# EAGLE design LinSen_beta (EAGLE 9.2.0)

## Sheet 1 of 5
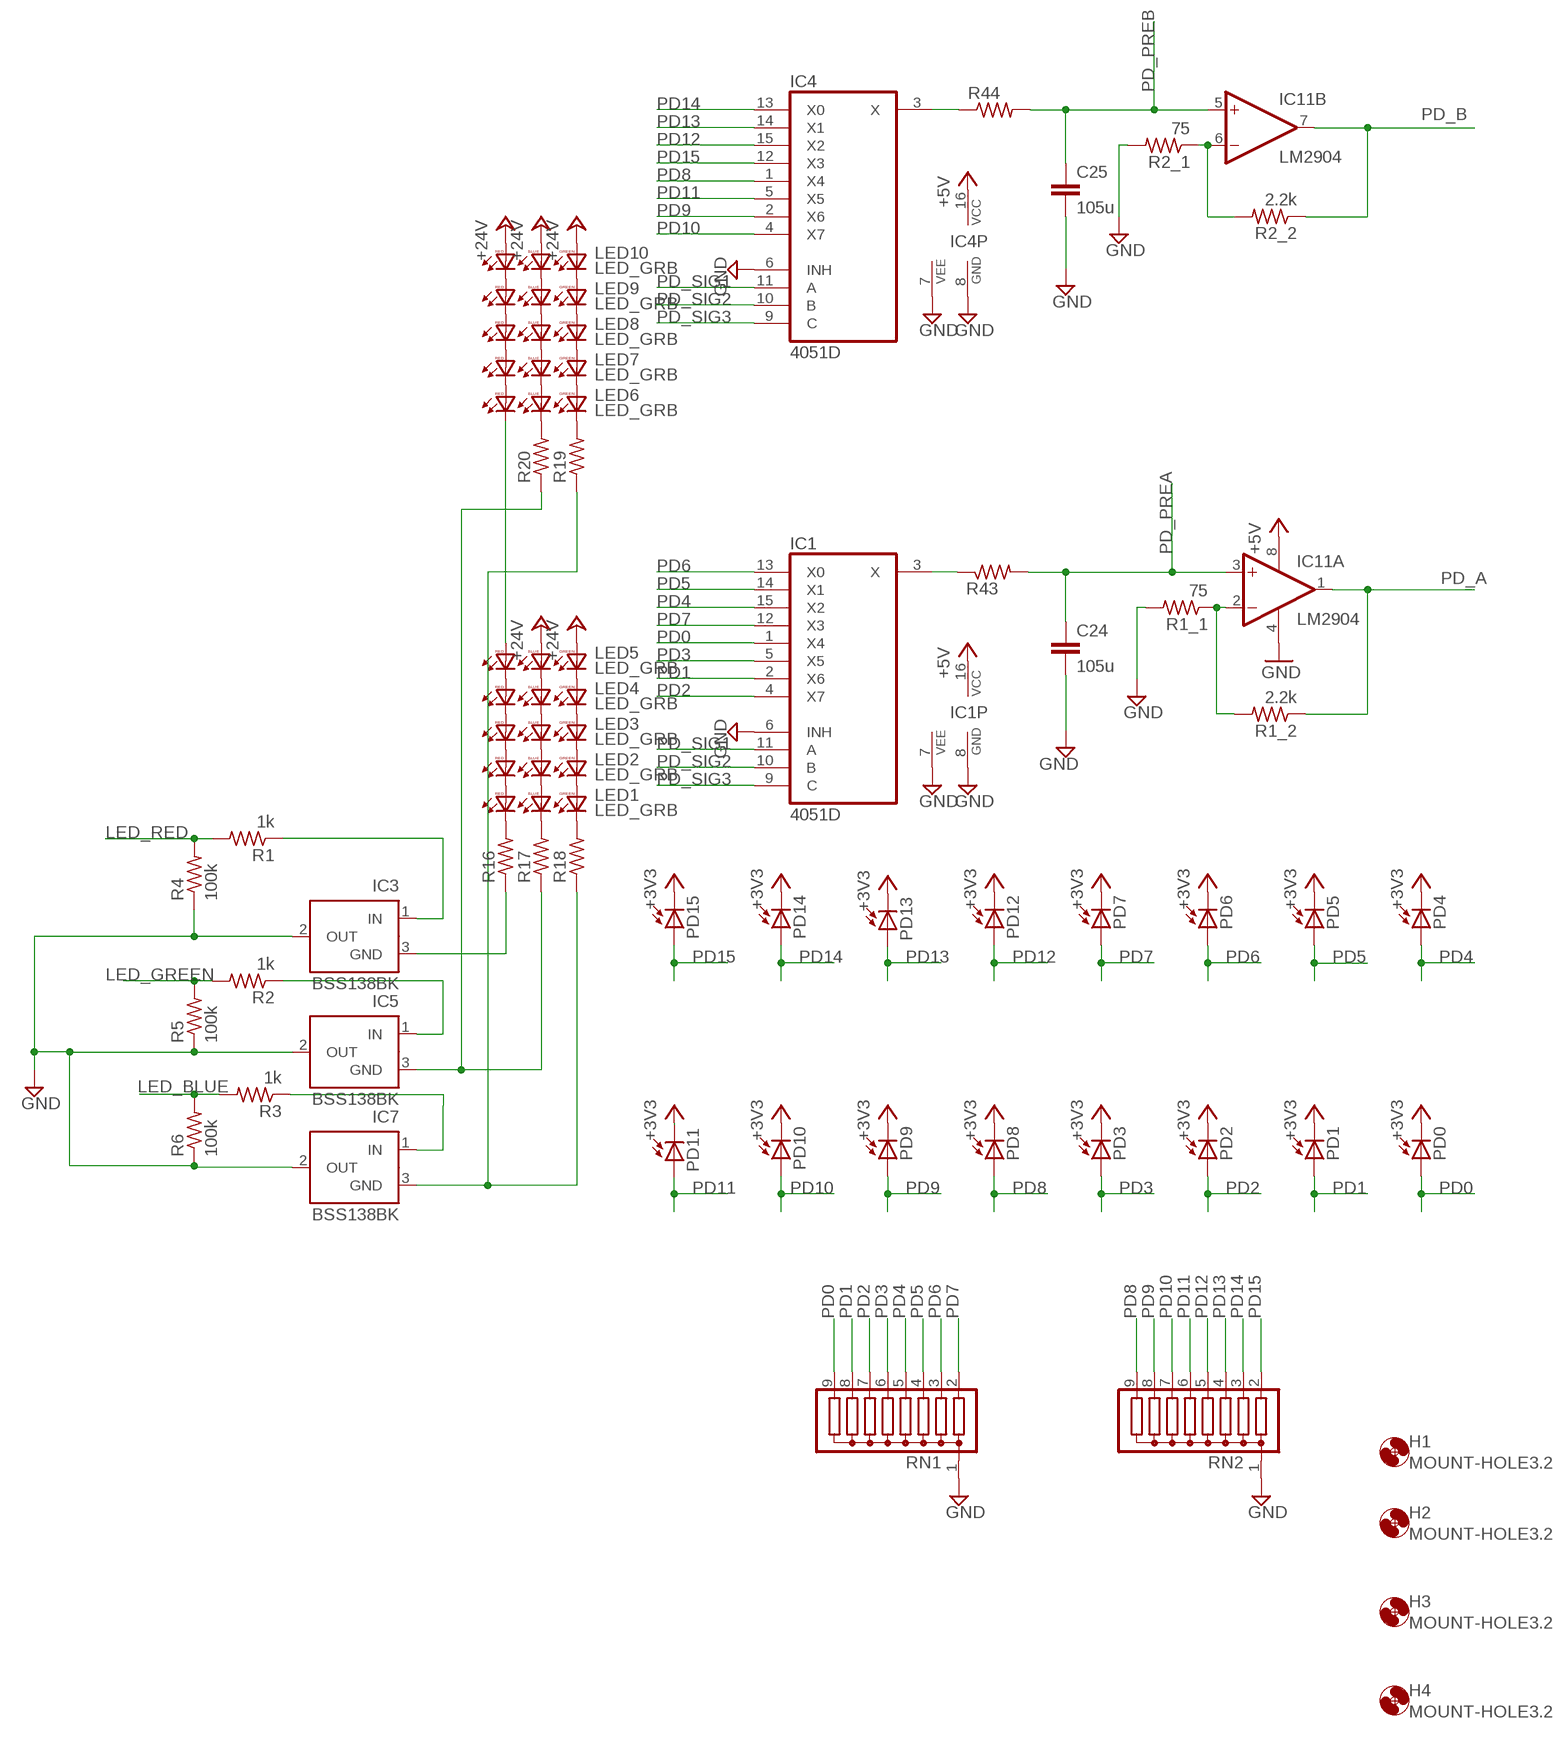
[diagram p0: schematic, sheet 1]

### Parts
C24  105u  C-EUC0805  [C0805]
C25  105u  C-EUC0805  [C0805]
H1  MOUNT-HOLE3.2  [3,2]
H2  MOUNT-HOLE3.2  [3,2]
H3  MOUNT-HOLE3.2  [3,2]
H4  MOUNT-HOLE3.2  [3,2]
IC1  4051D  [SO16]
IC3  BSS138BK  MAX6520  [SOT23]
IC4  4051D  [SO16]
IC5  BSS138BK  MAX6520  [SOT23]
IC7  BSS138BK  MAX6520  [SOT23]
IC11  LM2904  LM2903D  [SO08]
LED1  LED_GRB  [LED_GRB]
LED2  LED_GRB  [LED_GRB]
LED3  LED_GRB  [LED_GRB]
LED4  LED_GRB  [LED_GRB]
LED5  LED_GRB  [LED_GRB]
LED6  LED_GRB  [LED_GRB]
LED7  LED_GRB  [LED_GRB]
LED8  LED_GRB  [LED_GRB]
LED9  LED_GRB  [LED_GRB]
LED10  LED_GRB  [LED_GRB]
PD0  PDSFH229  [SFH229]
PD1  PDSFH229  [SFH229]
PD2  PDSFH229  [SFH229]
PD3  PDSFH229  [SFH229]
PD4  PDSFH229  [SFH229]
PD5  PDSFH229  [SFH229]
PD6  PDSFH229  [SFH229]
PD7  PDSFH229  [SFH229]
PD8  PDSFH229  [SFH229]
PD9  PDSFH229  [SFH229]
PD10  PDSFH229  [SFH229]
PD11  PDSFH229  [SFH229]
PD12  PDSFH229  [SFH229]
PD13  PDSFH229  [SFH229]
PD14  PDSFH229  [SFH229]
PD15  PDSFH229  [SFH229]
R1  1k  R-US_R0603  [R0603]
R1_1  75  R-US_R0603  [R0603]
R1_2  2.2k  R-US_R0603  [R0603]
R2  1k  R-US_R0603  [R0603]
R2_1  75  R-US_R0603  [R0603]
R2_2  2.2k  R-US_R0603  [R0603]
R3  1k  R-US_R0603  [R0603]
R4  100k  R-US_R0603  [R0603]
R5  100k  R-US_R0603  [R0603]
R6  100k  R-US_R0603  [R0603]
R16  R-US_R0603  [R0603]
R17  R-US_R0603  [R0603]
R18  R-US_R0603  [R0603]
R19  R-US_R0603  [R0603]
R20  R-US_R0603  [R0603]
R43  R-US_R0603  [R0603]
R44  R-US_R0603  [R0603]
RN1  G08R  [SIL9]
RN2  G08R  [SIL9]

### Nets
+3V3: PD0.K(C) PD1.K(C) PD2.K(C) PD3.K(C) PD4.K(C) PD5.K(C) PD6.K(C) PD7.K(C) PD8.K(C) PD9.K(C) PD10.K(C) PD11.K(C) PD12.K(C) PD13.K(C) PD14.K(C) PD15.K(C) ; also sheet 3,4
+5V: IC1.16(VCC) IC4.16(VCC) IC11.8(P:V+) ; also sheet 2,3,4,5
+24V: LED5.BA LED5.GA LED10.BA LED10.GA LED10.RA ; also sheet 2,4
GND: C24.2 C25.2 IC1.6(INH) IC1.7(VEE) IC1.8(GND) IC3.2(OUT) IC4.6(INH) IC4.7(VEE) IC4.8(GND) IC5.2(OUT) IC7.2(OUT) IC11.4(P:V-) R1_1.2 R2_1.2 R4.1 R5.1 R6.1 RN1.1 RN2.1 ; also sheet 2,3,4,5
LED_BLUE: R3.2 R6.2 ; also sheet 3
LED_GREEN: R2.2 R5.2 ; also sheet 3
LED_RED: R1.2 R4.2 ; also sheet 3
N$1: LED1.BA LED2.BC
N$2: LED1.GA LED2.GC
N$3: LED1.RA LED2.RC
N$5: LED2.BA LED3.BC
N$7: IC11.6(B:-IN) R2_1.1 R2_2.2
N$8: LED2.GA LED3.GC
N$9: LED2.RA LED3.RC
N$11: IC11.2(A:-IN) R1_1.1 R1_2.2
N$13: LED3.BA LED4.BC
N$14: LED3.GA LED4.GC
N$15: LED3.RA LED4.RC
N$16: LED4.BA LED5.BC
N$17: LED4.GA LED5.GC
N$18: LED4.RA LED5.RC
N$19: LED1.RC R16.2
N$20: LED1.GC R17.2
N$21: LED5.RA LED6.RC
N$22: LED6.BA LED7.BC
N$23: LED6.GA LED7.GC
N$24: LED6.RA LED7.RC
N$25: LED7.BA LED8.BC
N$26: LED7.GA LED8.GC
N$27: LED7.RA LED8.RC
N$28: LED8.BA LED9.BC
N$29: LED8.GA LED9.GC
N$30: LED8.RA LED9.RC
N$31: LED9.BA LED10.BC
N$32: LED9.GA LED10.GC
N$33: LED9.RA LED10.RC
N$42: IC4.3(X) R44.1
N$43: LED1.BC R18.2
N$49: IC1.3(X) R43.1
N$50: LED6.GC R20.2
N$51: LED6.BC R19.2
N$52: IC5.3(GND) R17.1 R20.1
N$53: IC3.1(IN) R1.1
N$54: IC3.3(GND) R16.1
N$284: IC5.1(IN) R2.1
N$285: IC7.3(GND) R18.1 R19.1
N$286: IC7.1(IN) R3.1
PD0: IC1.1(X4) PD0.A RN1.9
PD1: IC1.2(X6) PD1.A RN1.8
PD2: IC1.4(X7) PD2.A RN1.7
PD3: IC1.5(X5) PD3.A RN1.6
PD4: IC1.15(X2) PD4.A RN1.5
PD5: IC1.14(X1) PD5.A RN1.4
PD6: IC1.13(X0) PD6.A RN1.3
PD7: IC1.12(X3) PD7.A RN1.2
PD8: IC4.1(X4) PD8.A RN2.9
PD9: IC4.2(X6) PD9.A RN2.8
PD10: IC4.4(X7) PD10.A RN2.7
PD11: IC4.5(X5) PD11.A RN2.6
PD12: IC4.15(X2) PD12.A RN2.5
PD13: IC4.14(X1) PD13.A RN2.4
PD14: IC4.13(X0) PD14.A RN2.3
PD15: IC4.12(X3) PD15.A RN2.2
PD_A: IC11.1(A:OUT) R1_2.1 ; also sheet 3
PD_B: IC11.7(B:OUT) R2_2.1 ; also sheet 3
PD_PREA: C24.1 IC11.3(A:+IN) R43.2 ; also sheet 3
PD_PREB: C25.1 IC11.5(B:+IN) R44.2 ; also sheet 3
PD_SIG1: IC1.11(A) IC4.11(A) ; also sheet 3
PD_SIG2: IC1.10(B) IC4.10(B) ; also sheet 3
PD_SIG3: IC1.9(C) IC4.9(C) ; also sheet 3

## Sheet 2 of 5
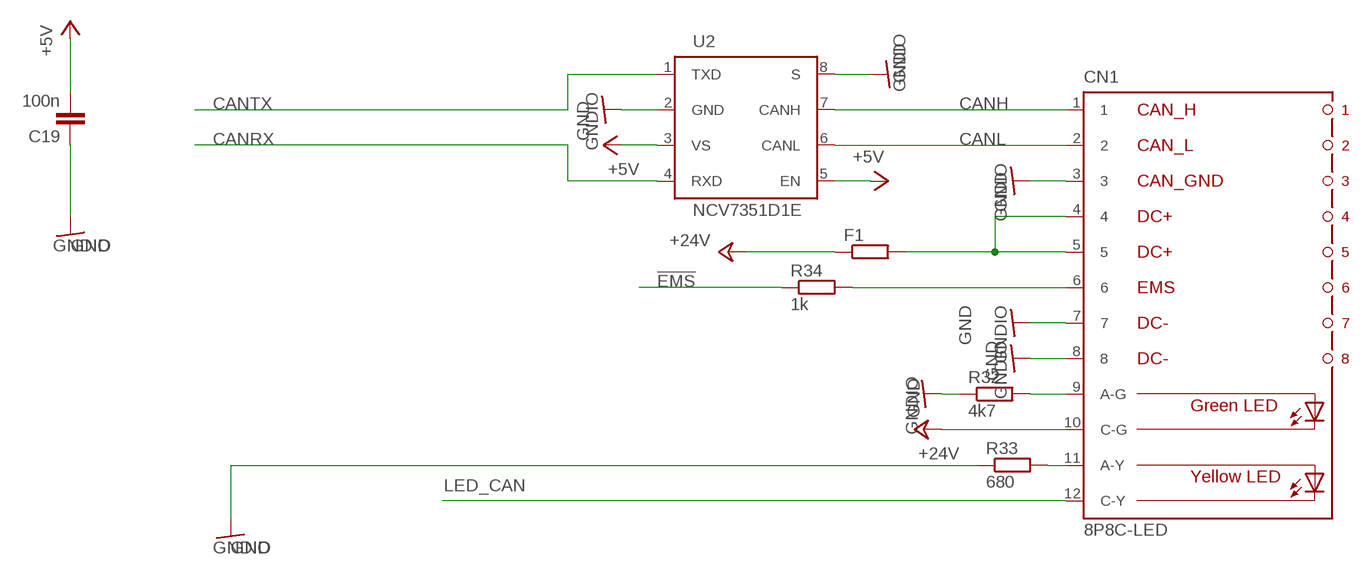
[diagram p1: schematic, sheet 2]

### Parts
C19  100n  C-EUC0603  [C0603]
CN1  8P8C-LED  [8P8C-LED]
F1  R-EU_R1206  [R1206]
R32  4k7  R-EU_R0603  [R0603]
R33  680  R-EU_R0603  [R0603]
R34  1k  R-EU_R0603  [R0603]
U2  NCV7351D1E  [SO08]

### Nets
!EMS: R34.1 ; also sheet 3
!EMS_ISO: CN1.6 R34.2
+5V: C19.2 U2.3(VS) U2.5(EN) ; also sheet 1,3,4,5
+24V: CN1.10(C-G) F1.1 ; also sheet 1,4
CANH: CN1.1 U2.7(CANH)
CANL: CN1.2 U2.6(CANL)
CANRX: U2.4(RXD) ; also sheet 3
CANTX: U2.1(TXD) ; also sheet 3
GND: C19.1 CN1.3 CN1.7 CN1.8 R32.1 R33.1 U2.2(GND) U2.8(S) ; supply symbol labelled GNDIO ; also sheet 1,3,4,5
LED_CAN: CN1.12(C-Y) ; also sheet 3
N$6: CN1.9(A-G) R32.2
N$12: CN1.11(A-Y) R33.2
N$36: CN1.4 CN1.5 F1.2

## Sheet 3 of 5
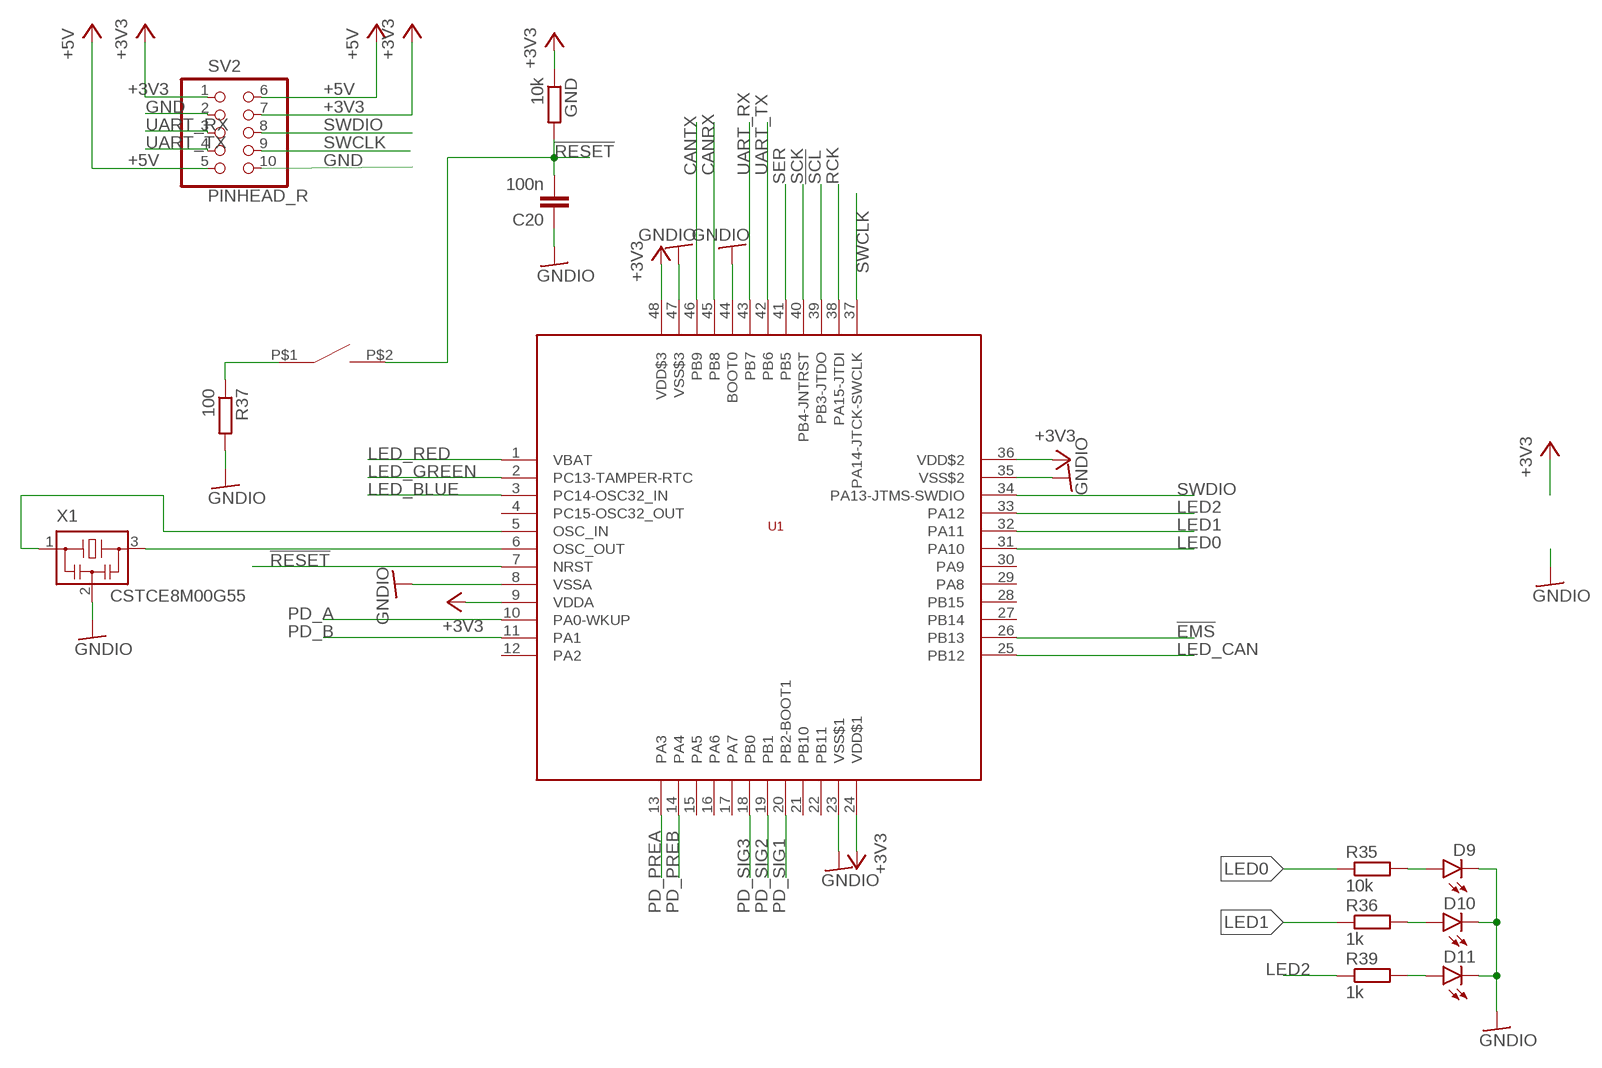
[diagram p2: schematic, sheet 3]

### Parts
C20  100n  C-EUC0603  [C0603]
D9  LEDCHIPLED_0805  [CHIPLED_0805]
D10  LEDCHIPLED_0805  [CHIPLED_0805]
D11  LEDCHIPLED_0805  [CHIPLED_0805]
GND  10k  R-EU_R0603  [R0603]
R35  10k  R-EU_R0603  [R0603]
R36  1k  R-EU_R0603  [R0603]
R37  100  R-EU_R0603  [R0603]
R39  1k  R-EU_R0603  [R0603]
SV2  PINHEAD_R  [PINHEDA_R]
SW1  SWITCH_TACTILETOP  [SWITCH_TACTILE_3X6]
U1  STM32F103C8  [LQFP48]
X1  CSTCE8M00G55  [CSTCE8M00G55]

### Nets
!EMS: U1.26(PB13) ; also sheet 2
!RESET: C20.2 GND.2 SW1.P$2 U1.7(NRST)
!SCL: U1.39(PB3-JTDO) ; also sheet 5
+3V3: GND.1 SV2.1 SV2.7 U1.9(VDDA) U1.24(VDD$1) U1.36(VDD$2) U1.48(VDD$3) ; also sheet 1,4
+5V: SV2.5 SV2.6 ; also sheet 1,2,4,5
CANRX: U1.45(PB8) ; also sheet 2
CANTX: U1.46(PB9) ; also sheet 2
GND: C20.1 D9.C D10.C D11.C R37.2 SV2.2 SV2.10 U1.8(VSSA) U1.23(VSS$1) U1.35(VSS$2) U1.44(BOOT0) U1.47(VSS$3) X1.2 ; supply symbol labelled GNDIO ; also sheet 1,2,4,5
LED0: R35.1 U1.31(PA10)
LED1: R36.1 U1.32(PA11)
LED2: R39.1 U1.33(PA12)
LED_BLUE: U1.3(PC14-OSC32_IN) ; also sheet 1
LED_CAN: U1.25(PB12) ; also sheet 2
LED_GREEN: U1.2(PC13-TAMPER-RTC) ; also sheet 1
LED_RED: U1.1(VBAT) ; also sheet 1
N$37: D10.A R36.2
N$38: D9.A R35.2
N$39: U1.6(OSC_OUT) X1.3
N$40: U1.5(OSC_IN) X1.1
N$41: R37.1 SW1.P$1
N$44: D11.A R39.2
PD_A: U1.10(PA0-WKUP) ; also sheet 1
PD_B: U1.11(PA1) ; also sheet 1
PD_PREA: U1.13(PA3) ; also sheet 1
PD_PREB: U1.14(PA4) ; also sheet 1
PD_SIG1: U1.20(PB2-BOOT1) ; also sheet 1
PD_SIG2: U1.19(PB1) ; also sheet 1
PD_SIG3: U1.18(PB0) ; also sheet 1
RCK: U1.38(PA15-JTDI) ; also sheet 5
SCK: U1.40(PB4-JNTRST) ; also sheet 5
SER: U1.41(PB5) ; also sheet 5
SWCLK: SV2.9 U1.37(PA14-JTCK-SWCLK)
SWDIO: SV2.8 U1.34(PA13-JTMS-SWDIO)
UART_RX: SV2.3 U1.43(PB7)
UART_TX: SV2.4 U1.42(PB6)
Unconnected: U1.4(PC15-OSC32_OUT) U1.12(PA2) U1.15(PA5) U1.16(PA6) U1.17(PA7) U1.21(PB10) U1.22(PB11) U1.27(PB14) U1.28(PB15) U1.29(PA8) U1.30(PA9)

## Sheet 4 of 5
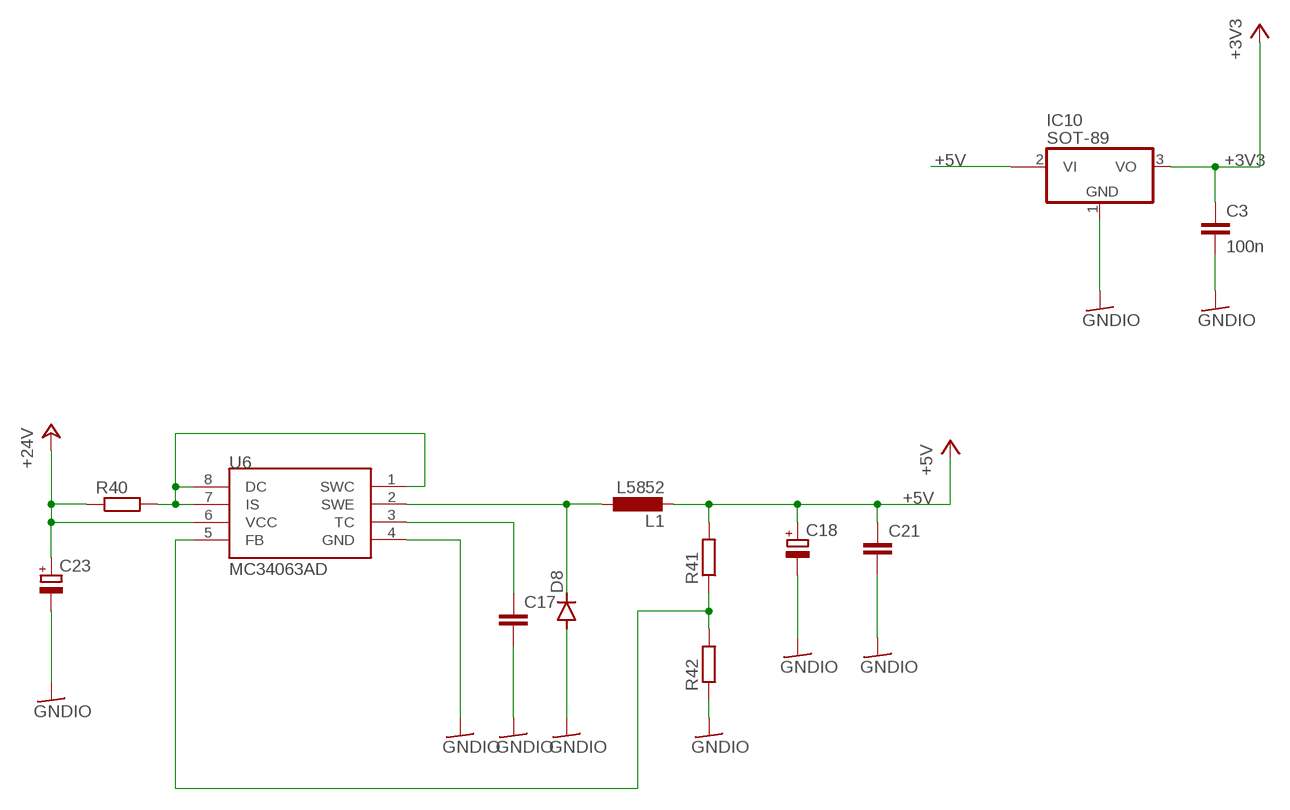
[diagram p3: schematic, sheet 4]

### Parts
C3  100n  C-EUC0603  [C0603]
C17  C-EUC0603  [C0603]
C18  CPOL-EUE2-5  [E2-5]
C21  C-EUC0603  [C0603]
C23  CPOL-EUE2-5  [E2-5]
D8  DIODE-SOD123  [SOD123]
IC10  SOT-89  MCP170312MB  [SOT89]
L1  L5852  [L5852]
R40  R-EU_R1206  [R1206]
R41  R-EU_R0603  [R0603]
R42  R-EU_R0603  [R0603]
U6  MC34063AD  [SOIC8]

### Nets
+3V3: C3.1 IC10.3(VO) ; also sheet 1,3
+5V: C18.+ C21.1 IC10.2@1(VI1) L1.P$2 R41.2 ; also sheet 1,2,3,5
+24V: C23.+ R40.1 U6.6(VCC) ; also sheet 1,2
GND: C3.2 C17.2 C18.- C21.2 C23.- D8.A IC10.1(GND) R42.1 U6.4(GND) ; supply symbol labelled GNDIO ; also sheet 1,2,3,5
N$45: R40.2 U6.1(SWC) U6.7(IS) U6.8(DC)
N$46: D8.C L1.P$1 U6.2(SWE)
N$47: C17.1 U6.3(TC)
N$48: R41.1 R42.2 U6.5(FB)
Unconnected: IC10.2(VI)

## Sheet 5 of 5
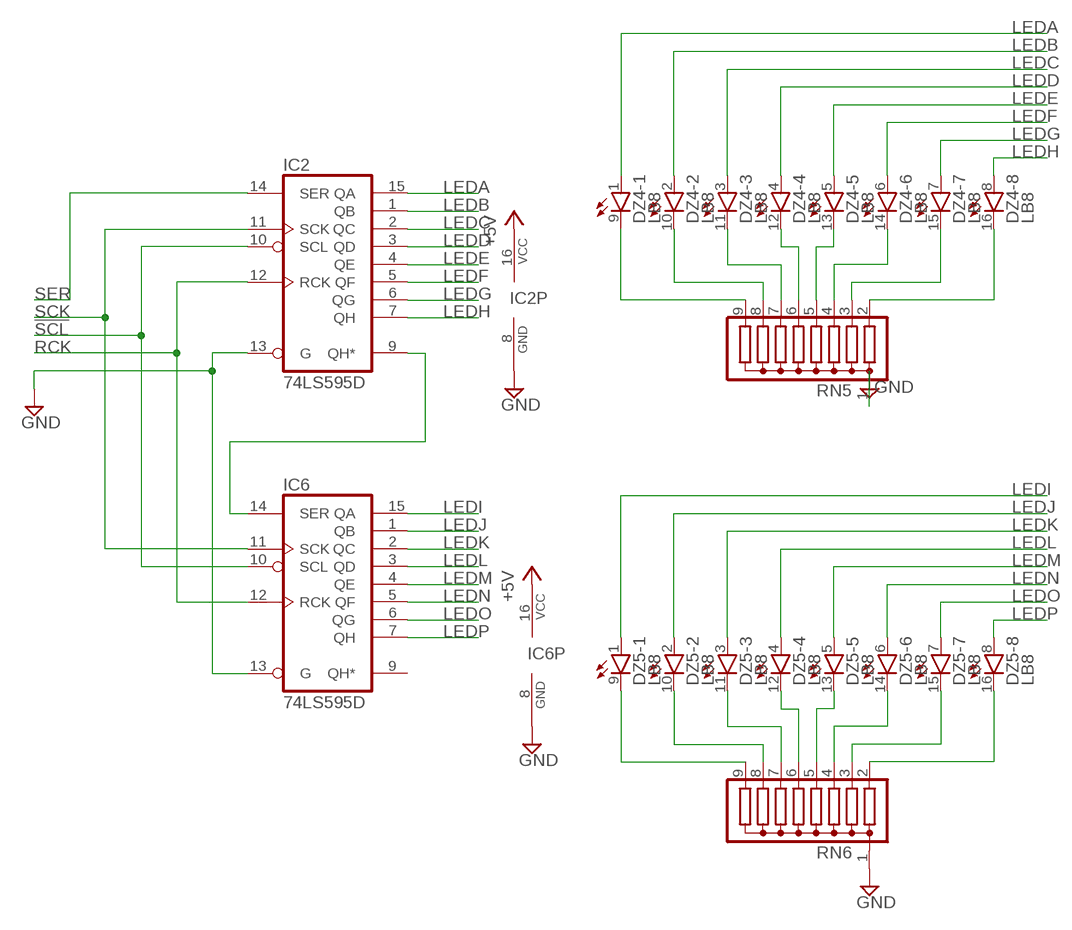
[diagram p4: schematic, sheet 5]

### Parts
DZ4  LB8  [LB8]
DZ5  LB8  [LB8]
IC2  74LS595D  [SO16]
IC6  74LS595D  [SO16]
RN5  G08R  [SIL9]
RN6  G08R  [SIL9]

### Nets
!SCL: IC2.10(SCL) IC6.10(SCL) ; also sheet 3
+5V: IC2.16(VCC) IC6.16(VCC) ; also sheet 1,2,3,4
GND: IC2.8(GND) IC2.13(G) IC6.8(GND) IC6.13(G) RN5.1 RN6.1 ; also sheet 1,2,3,4
LEDA: DZ4.1(-1:A) IC2.15(QA)
LEDB: DZ4.2(-2:A) IC2.1(QB)
LEDC: DZ4.3(-3:A) IC2.2(QC)
LEDD: DZ4.4(-4:A) IC2.3(QD)
LEDE: DZ4.5(-5:A) IC2.4(QE)
LEDF: DZ4.6(-6:A) IC2.5(QF)
LEDG: DZ4.7(-7:A) IC2.6(QG)
LEDH: DZ4.8(-8:A) IC2.7(QH)
LEDI: DZ5.1(-1:A) IC6.15(QA)
LEDJ: DZ5.2(-2:A) IC6.1(QB)
LEDK: DZ5.3(-3:A) IC6.2(QC)
LEDL: DZ5.4(-4:A) IC6.3(QD)
LEDM: DZ5.5(-5:A) IC6.4(QE)
LEDN: DZ5.6(-6:A) IC6.5(QF)
LEDO: DZ5.7(-7:A) IC6.6(QG)
LEDP: DZ5.8(-8:A) IC6.7(QH)
N$4: IC2.9(QH*) IC6.14(SER)
N$10: DZ4.9(-1:C) RN5.9
N$34: DZ4.10(-2:C) RN5.8
N$35: DZ4.11(-3:C) RN5.7
N$55: DZ4.12(-4:C) RN5.6
N$56: DZ4.13(-5:C) RN5.5
N$57: DZ4.14(-6:C) RN5.4
N$58: DZ4.15(-7:C) RN5.3
N$59: DZ4.16(-8:C) RN5.2
N$60: DZ5.12(-4:C) RN6.6
N$61: DZ5.11(-3:C) RN6.7
N$62: DZ5.10(-2:C) RN6.8
N$63: DZ5.9(-1:C) RN6.9
N$64: DZ5.13(-5:C) RN6.5
N$65: DZ5.14(-6:C) RN6.4
N$66: DZ5.15(-7:C) RN6.3
N$67: DZ5.16(-8:C) RN6.2
RCK: IC2.12(RCK) IC6.12(RCK) ; also sheet 3
SCK: IC2.11(SCK) IC6.11(SCK) ; also sheet 3
SER: IC2.14(SER) ; also sheet 3
Unconnected: IC6.9(QH*)

## Library data of the parts
C3 C19-C21 = rcl:C-EU: CAPACITOR, European symbol
C17 C24 C25 = rcl:C-EU: CAPACITOR, European symbol; SPICEPREFIX: C
C18 C23 = rcl:CPOL-EU: POLARIZED CAPACITOR, European symbol
CN1 = con-rj45:8P8C-LED: generic 8P8C connector with two LED's; OC_FARNELL: unknown; OC_NEWARK: unknown
D8 = diode:DIODE-: DIODE
D9-D11 = led:LED: LED OSRAM: - CHIPLED LG R971, LG N971, LY N971, LG Q971, LY Q971, LO R971, LY R971 LH N974, LH R974 LS Q976, LO Q976, LY Q976 LO Q996 - Hyper CHIPLED LW Q18S LB Q993, LB Q99A, LB R99A - SideLED LS A670, LO A670, LY A670, LG A670, LP A670 LB A673, LV A673, LT A673, LW A673 LH A674 LY A675 LS A676, LA A676, LO A676, LY A676, LW A676 LS A679, LY A679, LG A679 - Hyper Micro SIDELED® LS Y876, LA Y876, LO Y876, LY Y876 LT Y87S - SmartLED LW L88C, LW L88S LB L89C, LB L89S, LG L890 LS L89K, LO L89K, LY L89K LS L896, LA L896, LO L896, LY L896 - TOPLED LS T670, LO T670, LY T670, LG T670, LP T670 LSG T670, LSP T670, LSY T670, LOP T670, LYG T670 LG T671, LOG T671, LSG T671 LB T673, LV T673, LT T673, LW T673 LH T674 LS T676, LA T676, LO T676, LY T676, LB T676, LH T676, LSB T676, LW T676 LB T67C, LV T67C, LT T67C, LS T67K, LO T67K, LY T67K, LW E67C LS E67B, LA E67B, LO E67B, LY E67B, LB E67C, LV E67C, LT E67C LW T67C LS T679, LY T679, LG T679 LS T770, LO T770, LY T770, LG T770, LP T770 LB T773, LV T773, LT T773, LW T773 LH T774 LS E675, LA E675, LY E675, LS T675 LS T776, LA T776, LO T776, LY T776, LB T776 LHGB T686 LT T68C, LB T68C - Hyper Mini TOPLED® LB M676 - Mini TOPLED Santana® LG M470 LS M47K, LO M47K, LY M47K Source: http://www.osram.convergy.de LUXEON: - LUMILED® LXK2-PW12-R00, LXK2-PW12-S00, LXK2-PW14-U00, LXK2-PW14-V00 LXK2-PM12-R00, LXK2-PM12-S00, LXK2-PM14-U00 LXK2-PE12-Q00, LXK2-PE12-R00, LXK2-PE12-S00, LXK2-PE14-T00, LXK2-PE14-U00 LXK2-PB12-K00, LXK2-PB12-L00, LXK2-PB12-M00, LXK2-PB14-N00, LXK2-PB14-P00, LXK2-PB14-Q00 LXK2-PR12-L00, LXK2-PR12-M00, LXK2-PR14-Q00, LXK2-PR14-R00 LXK2-PD12-Q00, LXK2-PD12-R00, LXK2-PD12-S00 LXK2-PH12-R00, LXK2-PH12-S00 LXK2-PL12-P00, LXK2-PL12-Q00, LXK2-PL12-R00 Source: www.luxeon.com KINGBRIGHT: KA-3528ASYC Source: www.kingbright.com
DZ4 DZ5 = LinSen:LB8: LED BLOCK 10-LED bar graph, DIL, Siemens
F1 R32-R34 R40-R42 = rcl:R-EU_: RESISTOR, European symbol; SPICEPREFIX: R
GND R35-R37 R39 = rcl:R-EU_: RESISTOR, European symbol
H1-H4 = holes:MOUNT-HOLE: MOUNTING HOLE with drill center marker
IC1 = 40xx:4051: 8-channel ANALOG MULTIPLEXER; SPICEPREFIX: X
IC2 IC6 = 74xx-us:74*595: 8-bit SHIFT REGISTER, output latch
IC3 IC5 IC7 = maxim:MAX6520: 1.2V Voltage Reference 50ppm/°C, SOT23, 3-Terminal Source: Data sheet <http://datasheets.maxim-ic.com/en/ds/MAX6520.pdf>; MF: MAXIM; MPN: MAX6520EUR-T; OC_FARNELL: unknown; OC_NEWARK: 02J4586
IC4 = 40xx:4051: 8-channel ANALOG MULTIPLEXER
IC10 = linear:MCP1703*: 250 mA, 16V, Low Quiescent Current LDO Regulator Source: http://ww1.microchip.com/downloads/en/DeviceDoc/22049b.pdf
IC11 = linear:LM2903: COMPARATOR
L1 = l_ysk:L5852
LED1-LED10 = LineSenser:LED_GRB: Full color Z-Power LED RGB P5-II Series Source: http://www.seoulsemicon.co.kr .. F50360.pdf
PD0 PD1-PD15 = LineSenser:PD: LED OSRAM: - CHIPLED LG R971, LG N971, LY N971, LG Q971, LY Q971, LO R971, LY R971 LH N974, LH R974 LS Q976, LO Q976, LY Q976 LO Q996 - Hyper CHIPLED LW Q18S LB Q993, LB Q99A, LB R99A - SideLED LS A670, LO A670, LY A670, LG A670, LP A670 LB A673, LV A673, LT A673, LW A673 LH A674 LY A675 LS A676, LA A676, LO A676, LY A676, LW A676 LS A679, LY A679, LG A679 - Hyper Micro SIDELED® LS Y876, LA Y876, LO Y876, LY Y876 LT Y87S - SmartLED LW L88C, LW L88S LB L89C, LB L89S, LG L890 LS L89K, LO L89K, LY L89K LS L896, LA L896, LO L896, LY L896 - TOPLED LS T670, LO T670, LY T670, LG T670, LP T670 LSG T670, LSP T670, LSY T670, LOP T670, LYG T670 LG T671, LOG T671, LSG T671 LB T673, LV T673, LT T673, LW T673 LH T674 LS T676, LA T676, LO T676, LY T676, LB T676, LH T676, LSB T676, LW T676 LB T67C, LV T67C, LT T67C, LS T67K, LO T67K, LY T67K, LW E67C LS E67B, LA E67B, LO E67B, LY E67B, LB E67C, LV E67C, LT E67C LW T67C LS T679, LY T679, LG T679 LS T770, LO T770, LY T770, LG T770, LP T770 LB T773, LV T773, LT T773, LW T773 LH T774 LS E675, LA E675, LY E675, LS T675 LS T776, LA T776, LO T776, LY T776, LB T776 LHGB T686 LT T68C, LB T68C - Hyper Mini TOPLED® LB M676 - Mini TOPLED Santana® LG M470 LS M47K, LO M47K, LY M47K Source: http://www.osram.convergy.de LUXEON: - LUMILED® LXK2-PW12-R00, LXK2-PW12-S00, LXK2-PW14-U00, LXK2-PW14-V00 LXK2-PM12-R00, LXK2-PM12-S00, LXK2-PM14-U00 LXK2-PE12-Q00, LXK2-PE12-R00, LXK2-PE12-S00, LXK2-PE14-T00, LXK2-PE14-U00 LXK2-PB12-K00, LXK2-PB12-L00, LXK2-PB12-M00, LXK2-PB14-N00, LXK2-PB14-P00, LXK2-PB14-Q00 LXK2-PR12-L00, LXK2-PR12-M00, LXK2-PR14-Q00, LXK2-PR14-R00 LXK2-PD12-Q00, LXK2-PD12-R00, LXK2-PD12-S00 LXK2-PH12-R00, LXK2-PH12-S00 LXK2-PL12-P00, LXK2-PL12-Q00, LXK2-PL12-R00 Source: www.luxeon.com KINGBRIGHT: KA-3528ASYC Source: www.kingbright.com
R1 R1_1 R1_2 R2 R2_1 R2_2 R3-R6 R16-R20 R43 R44 = LineSenser:R-US_: RESISTOR, American symbol; SPICEPREFIX: R
RN1 RN2 RN5 RN6 = resistor-sil:G08R: SIL RESISTOR; OC_FARNELL: unknown; OC_NEWARK: unknown
SV2 = LinSen:PINHEAD_R
SW1 = switch-tactile:SWITCH_TACTILE
U1 = stm32_mcu:STM32F103C8: STMicroelectronics STM32F103C8 Mainstream Performance line, ARM Cortex-M3 MCU with 64 Kbytes Flash, 72 MHz CPU, motor control, USB and CAN references: datasheet <https://www.st.com/resource/en/datasheet/stm32f103c8.pdf> product page <https://www.st.com/ja/microcontrollers/stm32f103c8.html>
U2 = on-semi:NCV7351D1E: High Speed CAN Transceiver Source: NCV7351-D.PDF <http://www.onsemi.com/PowerSolutions/document/NCV7351-D.PDF>
U6 = mc34063:MC34063
X1 = resonator:CSTCE8M00G55

## Board
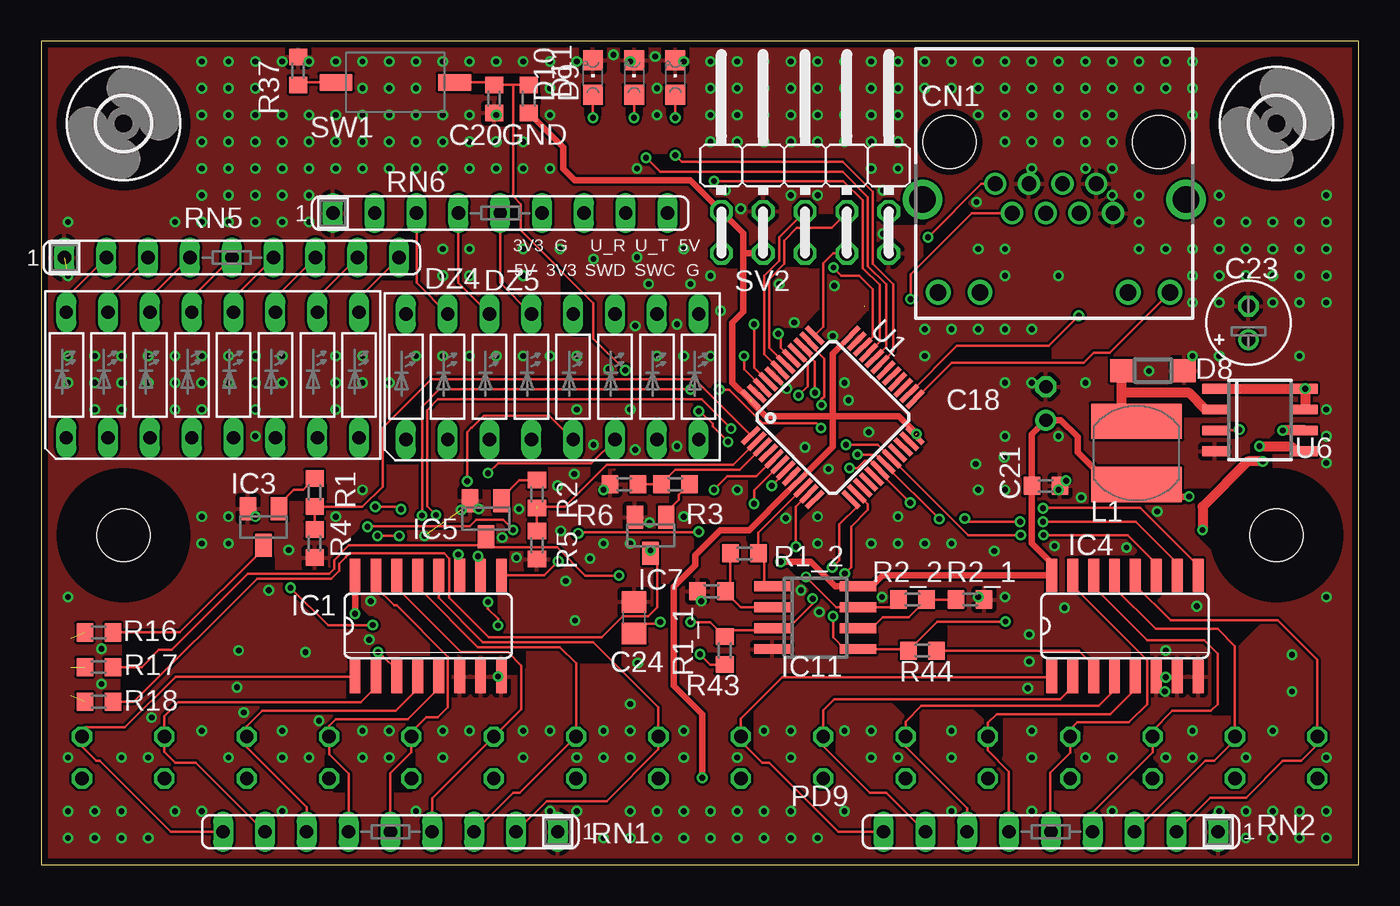
[diagram p5: board, top side]
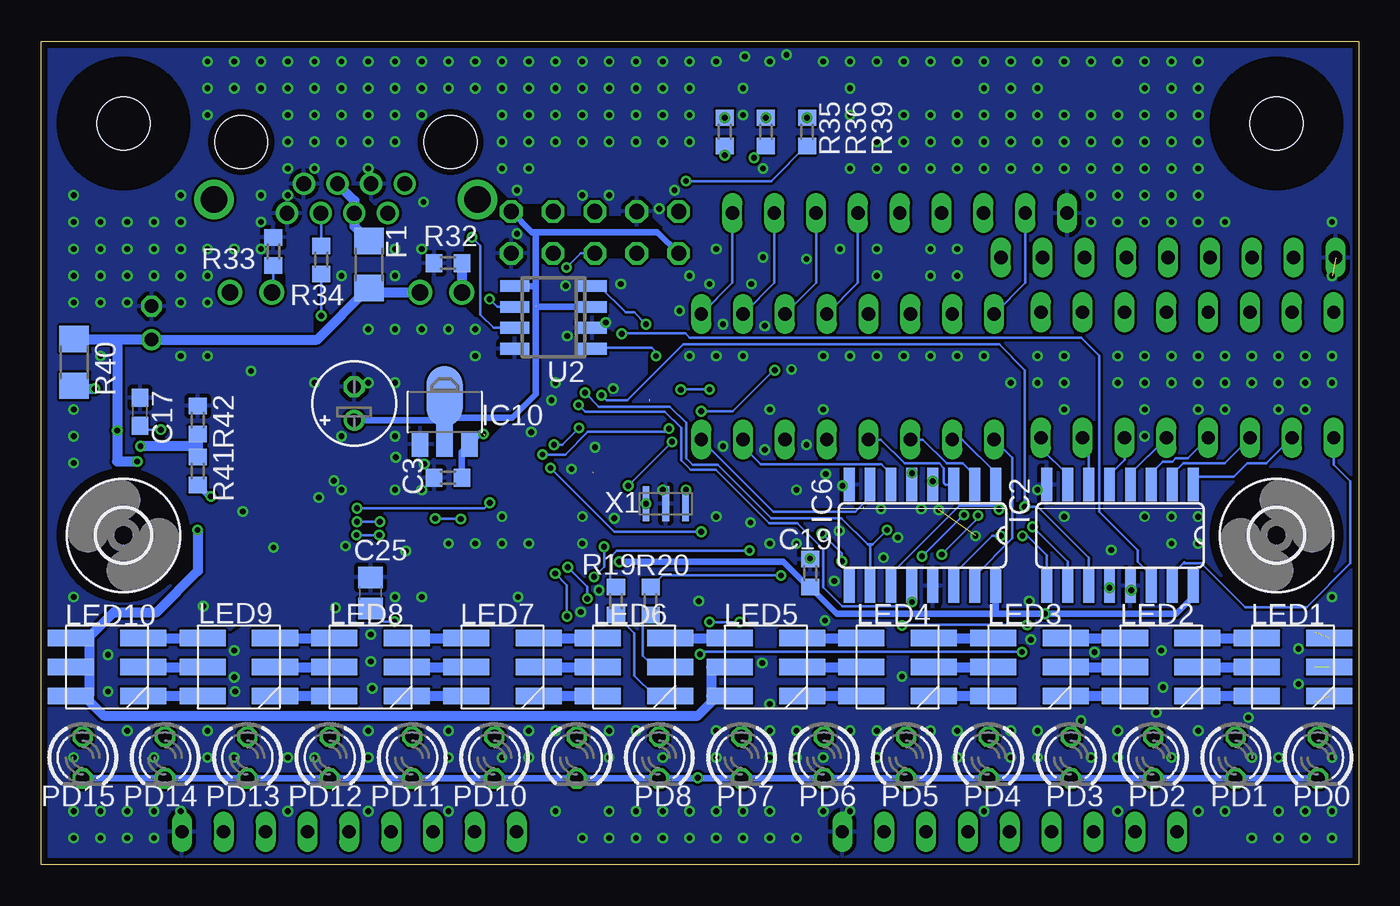
[diagram p6: board, bottom side, seen from below]

Size 80 x 50 mm. Coordinates in mm from the lower left corner, seen from the top.
Outline: 0,0 80,0 80,50 0,50 0,0
Copper layers (1*16): Top 0.035mm / dielectric 1.5mm / Bottom 0.035mm
Design rules "seeed_2layers": minimum track width 6mil, minimum drill 0.2mm, track to track 6mil, track to pad 6mil, pad to pad 6mil, via to via 6mil, smd to smd 0mil, copper to edge 0.4mm, drill to drill 12mil, minimum pad ring 0.15mm, minimum via ring 0.15mm, stop-mask expansion 4mil, vias tented up to drill 50mil, thermal gap 10mil

### Footprints (pad centres in the part's own frame; a part is rotated, then mirrored left to right if it is on the bottom)
C0603 = smd 1 x 1.1: 1 -0.85,0; 2 0.85,0
C0603' = smd 1.1 x 1: 1 -0.85,0; 2 0.85,0
E2-5 = drill 0.813 pad 1.27: + -1.016,0 | drill 0.813 pad 1.27 octagon: - 1.016,0
C0805 = smd 1.3 x 1.5: 1 -0.95,0; 2 0.95,0
8P8C-LED = drill 0.9 pad 1.3: 1 3.57,-3.81; 2 2.55,-2.03; 3 1.53,-3.81; 4 0.51,-2.03; 5 -0.51,-3.81; 6 -1.53,-2.03; 7 -2.55,-3.81; 8 -3.57,-2.03 | drill 1 pad 1.422: 9 7.04,2.78; 10 4.5,2.78; 11 -4.5,2.78; 12 -7.04,2.78 | drill 1.6 pad 2.184: M1 -8,-2.85; M2 8,-2.85 | hole 3.2: 6.35,-6.35; -6.35,-6.35
SOD123 = smd 1.4 x 1.4: A 1.9,0; C -1.9,0
CHIPLED_0805 = smd 1.2 x 1.2: A 0,-1.05; C 0,1.05
LB8 = drill 0.813 long: 1 -11.43,-3.81; 2 -8.89,-3.81; 3 -6.35,-3.81; 4 -3.81,-3.81; 5 -1.27,-3.81; 6 1.27,-3.81; 7 3.81,-3.81; 8 6.35,-3.81; 9 6.35,3.81; 10 3.81,3.81; 11 1.27,3.81; 12 -1.27,3.81; 13 -3.81,3.81; 14 -6.35,3.81; 15 -8.89,3.81; 16 -11.43,3.81
R1206 = smd 1.6 x 1.803: 1 -1.422,0; 2 1.422,0
R0603 = smd 1 x 1.1: 1 -0.85,0; 2 0.85,0
3,2 = hole 3.2: 0,0
SO16 = smd 0.66 x 2.032: 1 -4.445,-3.073; 2 -3.175,-3.073; 3 -1.905,-3.073; 4 -0.635,-3.073; 5 0.635,-3.073; 6 1.905,-3.073; 7 3.175,-3.073; 8 4.445,-3.073; 9 4.445,3.073; 10 3.175,3.073; 11 1.905,3.073; 12 0.635,3.073; 13 -0.635,3.073; 14 -1.905,3.073; 15 -3.175,3.073; 16 -4.445,3.073
SOT23 = smd 1 x 1.4: 1 -0.95,-1.1; 2 0.95,-1.1; 3 0,1.1
SOT89 = smd 1 x 1.5: 1 -1.499,-1.981; 3 1.499,-1.981 | smd 1 x 2: 2 0,-1.727 | smd 2.2 x 3.7: 2@1 0,0.94
SO08 = smd 0.6 x 2.2: 1 -1.905,-2.6; 2 -0.635,-2.6; 3 0.635,-2.6; 4 1.905,-2.6; 5 1.905,2.6; 6 0.635,2.6; 7 -0.635,2.6; 8 -1.905,2.6
L5852 = smd 2.15 x 5.5: P$1 1.925,0; P$2 -1.925,0
LED_GRB = smd 2.8 x 1: BA 2.2,1.75; BC -2.2,1.75; GA 2.2,0; GC -2.2,0; RA 2.2,-1.75; RC -2.2,-1.75
SFH229 = drill 0.813 octagon: A -1.275,0.02; K 1.265,0.02
SIL9 = drill 0.813 long: 1 -10.16,0; 2 -7.62,0; 3 -5.08,0; 4 -2.54,0; 5 0,0; 6 2.54,0; 7 5.08,0; 8 7.62,0; 9 10.16,0
PINHEDA_R = drill 0.914 octagon: 1 1.27,1.27; 2 3.81,1.27; 3 6.35,1.27; 4 8.89,1.27; 5 11.43,1.27; 6 1.27,-1.27; 7 3.81,-1.27; 8 6.35,-1.27; 9 8.89,-1.27; 10 11.43,-1.27
SWITCH_TACTILE_3X6 = smd 2 x 1: P$1 -3.6,0; P$2 3.6,0
LQFP48 = smd 1.4 x 0.3: 1 -4.3,2.75; 2 -4.3,2.25; 3 -4.3,1.75; 4 -4.3,1.25; 5 -4.3,0.75; 6 -4.3,0.25; 7 -4.3,-0.25; 8 -4.3,-0.75; 9 -4.3,-1.25; 10 -4.3,-1.75; 11 -4.3,-2.25; 12 -4.3,-2.75; 25 4.3,-2.75; 26 4.3,-2.25; 27 4.3,-1.75; 28 4.3,-1.25; 29 4.3,-0.75; 30 4.3,-0.25; 31 4.3,0.25; 32 4.3,0.75; 33 4.3,1.25; 34 4.3,1.75; 35 4.3,2.25; 36 4.3,2.75 | smd 0.3 x 1.4: 13 -2.75,-4.3; 14 -2.25,-4.3; 15 -1.75,-4.3; 16 -1.25,-4.3; 17 -0.75,-4.3; 18 -0.25,-4.3; 19 0.25,-4.3; 20 0.75,-4.3; 21 1.25,-4.3; 22 1.75,-4.3; 23 2.25,-4.3; 24 2.75,-4.3; 37 2.75,4.3; 38 2.25,4.3; 39 1.75,4.3; 40 1.25,4.3; 41 0.75,4.3; 42 0.25,4.3; 43 -0.25,4.3; 44 -0.75,4.3; 45 -1.25,4.3; 46 -1.75,4.3; 47 -2.25,4.3; 48 -2.75,4.3
SO08' = smd 0.72 x 1.78: 1 -1.905,-2.35; 2 -0.635,-2.35; 3 0.635,-2.35; 4 1.905,-2.35; 5 1.905,2.35; 6 0.635,2.35; 7 -0.635,2.35; 8 -1.905,2.35
SOIC8 = smd 0.6 x 1.5: 1 -1.905,-2.75; 2 -0.635,-2.75; 3 0.635,-2.75; 4 1.905,-2.75; 5 1.905,2.75; 6 0.635,2.75; 7 -0.635,2.75; 8 -1.905,2.75
CSTCE8M00G55 = smd 0.4 x 2.1: 1 -1.2,0; 2 0,0; 3 1.2,0

### Placement (x,y rotation side)
C3  55.3,23.5 180 bottom
C17  [C0603']  74,27.5 90 bottom
C18  61,28 90 bottom
C19  33.3,17.7 270 bottom
C20  27.5,46.5 90 top
C21  61,23 0 top
C23  73.3,32.9 90 top
C24  36,15 90 top
C25  60,16.5 90 bottom
CN1  61.5,37.53 180 top
D8  67.5,30 0 top
D9  38.5,47.8 0 top
D10  36,47.8 0 top
D11  33.5,47.8 0 top
DZ4  12.96,29.73 0 top
DZ5  33.57,29.62 0 top
F1  60.1,36.44 90 bottom
GND  29.6,46.5 90 top
H1  75,20 90 bottom
H2  5,45 0 top
H3  75,45 0 top
H4  5,20 0 bottom
IC1  23.5,14.5 0 top
IC2  14.5,20 180 bottom
IC3  13.5,20.5 180 top
IC4  65.8,14.5 0 top
IC5  27,21 180 top
IC6  26.5,20 180 bottom
IC7  37,20 180 top
IC10  55.5,27.5 0 bottom
IC11  47,15 270 top
L1  66.5,25 90 top
LED1  4,12 180 bottom
LED2  12,12 180 bottom
LED3  20,12 180 bottom
LED4  28,12 180 bottom
LED5  36,12 180 bottom
LED6  44,12 180 bottom
LED7  52,12 180 bottom
LED8  60,12 180 bottom
LED9  68,12 180 bottom
LED10  76,12 180 bottom
PD0  2.5,6.5 270 bottom
PD1  7.5,6.5 270 bottom
PD2  12.5,6.5 270 bottom
PD3  17.5,6.5 270 bottom
PD4  22.5,6.5 270 bottom
PD5  27.5,6.5 270 bottom
PD6  32.5,6.5 270 bottom
PD7  37.5,6.5 270 bottom
PD8  42.5,6.5 270 bottom
PD9  47.5,6.5 270 bottom
PD10  52.5,6.5 270 bottom
PD11  57.5,6.5 270 bottom
PD12  62.5,6.5 270 bottom
PD13  67.5,6.5 270 bottom
PD14  72.5,6.5 270 bottom
PD15  77.5,6.5 270 bottom
R1  16.6,22.6 270 top
R1_1  40.7,16.6 180 top
R1_2  42.7,18.9 180 top
R2  30.1,22.5 270 top
R2_1  56.4,16.1 0 top
R2_2  52.9,16.1 0 top
R3  38.5,23.1 180 top
R4  16.6,19.5 90 top
R5  30.1,19.4 90 top
R6  35.4,23.1 0 top
R16  3.5,14.1 180 top
R17  3.5,12 180 top
R18  3.5,9.9 180 top
R19  45.1,16 270 bottom
R20  43,16 270 bottom
R32  55.3,36.52 0 bottom
R33  65.9,37.24 270 bottom
R34  63,36.73 90 bottom
R35  38.5,44.5 90 bottom
R36  36,44.5 90 bottom
R37  15.6,48.2 90 top
R39  33.5,44.5 90 bottom
R40  78,30.5 270 bottom
R41  70.5,23.9 270 bottom
R42  70.5,27 270 bottom
R43  41.5,13 90 top
R44  53.5,13 180 top
RN1  21.2,2 180 top
RN2  61.3,2 180 top
RN5  11.57,36.86 0 top
RN6  27.87,39.56 0 top
SV2  40.03,38.39 0 top
SW1  21.5,47.5 0 top
U1  48.07,27.16 45 top
U2  NCV7351D1E  [SO08']  48.9,33.23 90 bottom
U6  74,27 270 top
X1  42.08,21.91 180 bottom

### Tracks (layer width: path | path; a pad name or v marks a point on that pad's centre or on a via)
!EMS  (via drill 0.35)
  Top 0.152: U1.26 55.59,31.5 61.16,31.5 v62.99,33.33
  Bottom 0.152: v62.99,33.33 63,33.33 R34.1
!EMS_ISO
  Bottom 0.152: R34.2 63,39.53 CN1.6
!RESET  (via drill 0.35)
  Top 0.152: SW1.P$2 27.35,47.5 C20.2 GND.2 28.65,47.35 28.65,40.57 29.11,40.11 29.11,38.51 33.53,34.09 33.53,31.95 v35.46,30.02 | U1.7 45.21,23.86 v44.35,23.01 | v41.7,25.67 40.76,26.61 40.76,26.77 39.96,27.57 v39.93,27.53
  Bottom 0.152: v44.35,23.01 41.7,25.66 v41.7,25.67 | v39.93,27.53 38,27.53 35.51,30.02 v35.46,30.02
!SCL  (via drill 0.35)
  Top 0.152: v28.65,20.32 28.04,20.93 26.41,20.93 26.02,20.54 19.83,20.54 v19.81,20.52 | U1.39 46.27,31.27 46.98,30.55 v46.98,28.65
  Bottom 0.152: IC2.10 17.68,18.39 v19.81,20.52 | v28.65,20.32 29.52,19.45 | 29.52,19.45 29.68,19.3 | 29.68,19.3 IC6.10 | 29.83,19.45 31.41,21.03 35.66,21.03 38.91,24.28 40.44,24.28 40.84,24.69 40.84,26.82 41.84,27.82 46.15,27.82 v46.98,28.65 | 29.83,19.45 29.68,19.3 | 29.52,19.45 29.83,19.45
+3V3  (via drill 0.35)  (3 unrouted)
  Top 0.152: 42.99,20.31 43.04,20.36 | 46.44,23.76 U1.9 45.31,22.63 | 48.54,31.52 U1.36 | U1.48 42.98,28.25
  Top 0.406: GND.1 31.7,43.55 31.7,42.27 32.41,41.55 39.41,41.55 SV2.1 42.63,38.33 42.63,37.19 | v40.13,5.28 40.13,9.14 38.41,10.87 38.41,16.87 39.73,18.19 39.73,18.8 41.24,20.31 42.99,20.31 | 43.04,20.36 45.31,22.63 | v53.15,26.15 52.07,27.23 48.06,27.23 | 43.08,28.15 44,27.23 48.06,27.23 | 48.06,27.23 48.06,25.38 46.52,23.84 | 48.06,27.23 48.06,31.04 48.54,31.52 | 42.98,28.25 41.96,29.28 41.96,32.92 42.63,33.59 42.63,37.19 | SV2.7 42.7,37.12 42.63,37.19
  Bottom 0.406: PD15.K PD14.K PD13.K PD12.K PD11.K PD10.K PD9.K PD8.K 40.13,5.24 | 40.13,5.24 PD7.K PD6.K PD5.K PD4.K 22.43,5.28 17.53,5.28 PD3.K PD2.K PD1.K PD0.K | 40.13,5.24 v40.13,5.28 | v53.15,26.15 53.37,26.15 IC10.3 54.45,25.07 C3.1
+5V  (via drill 0.35)  (1 unrouted)
  Top 0.406: v69.7,22.35 67.22,22.35 L1.P$2 64.91,23.07 62.93,25.05 62.93,25.97 61.91,26.98 C18.+ 60.15,26.13 C21.1 60.15,19.5 61.35,18.3 IC4.16 51.1,17.58 50.43,16.91 IC11.8 48.22,16.91 46.74,18.39 v44.91,18.39 | IC1.16 v19.05,15.24
  Bottom 0.152: IC2.16 10.05,16.26
  Bottom 0.406: v69.7,22.35 69.8,22.35 R41.2 | C18.+ 55.5,26.98 IC10.2@1 55.5,27.13 51.41,27.13 49.99,28.55 49.99,33.95 | U2.5 49.99,35.13 | U2.3 49.99,33.86 49.99,35.13 | 10.05,16.26 11.07,15.24 v19.05,15.24 22.05,15.24 | v44.91,18.39 34.95,18.39 33.41,16.85 C19.2 31.69,15.24 22.05,15.24 | 22.05,15.24 IC6.16 | SV2.6 42.59,38.41 49.99,38.41 | SV2.5 50.2,38.41 49.99,38.41 | 49.99,35.13 49.99,38.41
+24V  (via drill 0.35)
  Top 0.61: U6.6 v75.39,26.36 | v75.39,26.36 | v74.17,24.49 73.25,24.49 70.51,21.74 v70.51,20.32
  Bottom 0.61: CN1.10 59.84,34.75 F1.1 63.23,31.88 C23.+ 75.39,31.88 | 75.39,31.88 77.96,31.88 R40.1 | 75.39,31.88 v75.39,26.36 75.39,24.49 v74.17,24.49 | v70.51,20.32 70.49,20.3 70.49,17.83 72.98,15.34 75.59,15.34 77.18,13.75 LED10.RA 77.08,13.75 77.08,12 | 77.08,12 77.08,10.25 LED10.BA 77.41,10.25 76.2,9.04 40.13,9.04 38.92,10.25 LED5.BA 39.32,10.25 39.32,12 LED5.GA | LED10.GA 77.08,12
CANH  (via drill 0.35)
  Top 0.152: CN1.1 57.09,41.34 v53.85,38.1
  Bottom 0.152: v53.85,38.1 53.34,37.59 53.34,33.41 52.53,32.59 U2.7
CANL  (via drill 0.35)
  Top 0.152: CN1.2 56.49,39.56 52.79,35.86 v52.79,34.34
  Bottom 0.152: v52.79,34.34 52.31,33.86 U2.6
CANRX  (via drill 0.35)
  Top 0.152: U1.45 43.28,30.18 v43.28,32.82
  Bottom 0.152: U2.4 46.1,35.13 44.5,33.53 43.99,33.53 v43.28,32.82
CANTX  (via drill 0.35)
  Top 0.152: 43.84,28.91 U1.46 42.68,30.08 v42.68,30.89
  Bottom 0.152: U2.1 45.99,31.32 45.92,31.39 42.93,31.39 42.65,31.11 42.65,30.91 v42.68,30.89
GND  (via drill 0.35)  (2 unrouted)
  other vias: 9.75,45.52 13,45.52 9.75,42.27 13,42.27 13,39.01 9.75,39.01 16.26,42.27 16.26,39.01 19.51,42.27 19.51,45.52 22.76,45.52 22.76,42.27 26.01,42.27 42.27,45.52 45.52,45.52 48.77,45.52 52.02,45.52 52.02,42.27 58.52,45.52 61.77,45.52 65.02,45.52 65.02,42.27 71.53,39.01 71.53,35.76 74.78,35.76 78.03,35.76 61.77,35.76 58.52,35.76 29.26,35.76 26.01,35.76 3.25,29.26 6.5,29.26 9.75,29.26 13,29.26 19.51,29.26 48.77,29.26 58.52,29.26 78.03,26.01 61.77,22.76 61.77,26.01 58.52,26.01 58.52,22.76 42.27,22.76 13,26.01 9.75,19.51 55.27,19.51 52.02,19.51 35.76,19.51 78.03,16.26 58.52,16.26 68.28,13 78.03,6.5 78.03,3.25 74.78,3.25 71.53,3.25 68.28,6.5 65.02,6.5 65.02,3.25 55.27,6.5 55.27,3.25 52.02,6.5 48.77,3.25 45.52,3.25 45.52,6.5 42.27,3.25 42.27,6.5 39.01,6.5 39.01,3.25 35.76,3.25 35.76,6.5 32.51,6.5 32.51,3.25 29.26,6.5 19.51,6.5 16.26,6.5 9.75,3.25 6.5,6.5 3.25,3.25 4.88,3.25 8.13,3.25 4.88,6.5 3.25,1.63 4.88,1.63 6.5,1.63 1.63,3.25 1.63,1.63 1.63,6.5 11.38,6.5 14.63,6.5 14.63,3.25 21.13,6.5 22.76,3.25 24.38,6.5 24.38,8.13 26.01,8.13 21.13,8.13 19.51,8.13 16.87,8.74 14.63,8.13 29.26,8.13 9.75,8.13 30.89,8.13 30.89,3.25 34.14,1.63 35.76,1.63 34.14,6.5 34.14,8.13 35.76,8.13 39.01,8.13 37.39,3.25 37.39,1.63 39.01,1.63 40.64,1.63 40.64,3.25 42.27,1.63 43.89,3.25 43.89,1.63 45.52,1.63 47.14,1.63 43.89,8.13 45.52,8.13 48.77,8.13 50.39,8.13 50.39,6.5 55.27,8.13 60.15,8.13 60.15,6.5 60.15,3.25 63.4,6.5 69.9,8.13 69.9,6.5 73.15,3.25 76.4,3.25 76.4,1.63 74.78,1.63 73.15,1.63 78.03,1.63 73.15,6.5 74.78,8.13 68.28,11.38 56.9,16.26 35.76,9.75 1.63,16.26 11.38,19.51 11.38,21.13 9.75,21.13 13,21.13 17.88,21.13 19.51,22.76 34.14,22.76 34.14,19.51 39.01,21.13 47.14,21.13 47.14,19.51 50.39,19.51 53.64,19.51 52.02,21.13 56.9,22.76 67.77,21.44 78.03,24.38 76.4,30.89 71.53,30.89 69.9,30.89 63.4,29.26 60.15,29.26 40.64,30.89 39.01,30.89 37.39,30.89 32.51,30.89 32.51,27.64 35.76,27.64 29.26,30.89 30.89,30.89 27.64,30.89 26.01,30.89 24.38,30.89 22.76,30.89 21.13,29.26 17.88,29.26 17.88,30.89 19.51,30.89 17.88,27.64 14.63,29.26 14.63,30.89 13,30.89 13,27.64 9.75,27.64 11.38,29.26 11.38,30.89 9.75,30.89 8.13,29.26 8.13,27.64 4.88,27.64 4.88,29.26 4.88,30.89 6.5,30.89 8.13,30.89 3.25,30.89 1.63,30.89 1.63,29.26 3.25,27.64 1.63,35.76 1.63,39.01 11.38,39.01 8.13,39.01 9.75,40.64 11.38,40.64 13,40.64 14.63,40.64 14.63,39.01 16.26,40.64 24.38,35.76 24.38,37.39 26.01,37.39 29.26,37.39 24.38,42.27 21.13,42.27 9.75,43.89 11.38,43.89 11.38,45.52 11.38,42.27 13,43.89 14.63,42.27 17.88,42.27 19.51,43.89 17.88,43.89 21.13,45.52 21.13,43.89 22.76,43.89 24.38,43.89 26.01,43.89 27.64,42.27 30.89,45.52 40.64,45.52 40.64,43.89 42.27,43.89 41.55,40.94 43.89,43.89 42.47,39.83 45.52,40.64 45.52,43.89 43.89,45.52 47.14,45.52 47.14,43.89 47.14,40.64 48.77,43.89 50.39,45.52 50.39,43.89 50.39,42.27 52.02,43.89 56.9,45.52 58.52,43.89 53.64,30.89 66.65,37.39 60.15,43.89 60.15,45.52 61.77,43.89 63.4,45.52 63.4,43.89 63.4,42.27 65.02,40.64 65.02,43.89 69.9,45.52 66.65,39.01 69.9,34.14 69.9,35.76 71.53,37.39 73.15,35.76 73.15,37.39 74.78,37.39 76.4,37.39 76.4,35.76 78.03,37.39 71.53,34.14 74.78,34.14 76.4,34.14 78.03,34.14 78.03,27.64 41.25,33.63 13.82,16.66 11.99,13 3.66,13.11 3.66,10.97 11.89,10.77 6.71,8.94 12.29,9.25 16.05,12.9 15.04,19.1 23.27,19.96 20.02,16 19.91,13.67 27.74,11.43 28.85,18.64 27.99,19.86 26.57,21.59 31.55,20.27 29.01,21.59 31.34,23.01 31.85,17.22 40.08,16 36.93,20.78 47.8,24.03 46.38,25.35 50.24,26.26 49.02,28.19 58.47,24.74 56.74,24.33 57.86,19.05 59.99,12.34 59.99,13.97 59.89,10.72 68.22,10.52 75.95,10.52 75.95,12.75 70.15,15.7 62.13,15.6 62.23,23.32 33.53,36.78 36.88,35.26 36.07,32.72 38.61,32.82 39.42,35.26 31.5,37.39 32.41,14.83 33.32,18.59 25.5,21.54 32.36,23.72 36.22,12.24 61.52,19.35 65.89,19.25 63.14,22.3 67.26,29.97 51.05,16.26 47.24,15.34 46.13,16.66 45.21,21.03 45.26,28.91 36.17,36.88 33.53,25.5 36.07,25.2 38.61,25.4 34.44,30.07 9.75,47.14 9.75,48.77 11.38,48.77 11.38,47.14 13,48.77 13,47.14 14.63,45.52 14.63,48.77 16.26,48.77 16.26,45.52 16.26,43.89 14.63,43.89 17.88,45.52 21.13,47.14 21.13,48.77 24.38,45.52 26.01,45.52 27.64,45.52 30.89,47.14 30.89,48.77 29.26,48.77 27.64,48.77 26.01,48.77 24.38,48.77 22.76,48.77 22.76,47.14 19.51,47.14 19.51,48.77 17.88,48.77 32.51,48.77 34.75,49.17 35.76,48.77 37.29,49.07 39.01,48.77 40.64,48.77 27.64,43.89 29.26,43.89 29.26,42.27 30.89,42.27 37.39,47.14 37.39,45.52 40.64,47.14 42.27,47.14 42.27,48.77 43.89,48.77 43.89,47.14 45.52,47.14 45.52,48.77 47.14,48.77 47.14,47.14 48.77,47.14 50.39,47.14 52.02,47.14 52.02,48.77 50.39,48.77 48.77,48.77 56.9,47.14 55.27,47.14 53.64,47.14 53.64,48.77 55.27,48.77 56.9,48.77 58.52,48.77 58.52,47.14 60.15,47.14 60.15,48.77 61.77,48.77 63.4,48.77 65.02,48.77 61.77,47.14 63.4,47.14 65.02,47.14 66.65,47.14 66.65,48.77 68.28,48.77 69.9,48.77 69.9,47.14 68.28,47.14 60.15,42.27 58.52,37.39 56.9,37.39 53.64,32.51 55.27,32.51 56.9,32.51 58.52,32.51 60.15,32.51 66.65,40.64 68.28,37.39 69.9,37.39 73.15,39.01 71.53,40.64 74.78,39.01 76.4,39.01 78.03,39.01 78.03,40.64 40.64,35.76 39.01,37.39 48.16,35.15 48.06,32.11 45.72,32.92 44.81,35.26 36.17,42.27 51.1,40.94 56.79,40.23 51.1,38.3
  pour Bottom: 0,0 0,50 80,50 80,0
  pour Top: 0,0 0,50 80,50 80,0
  cutout Bottom: 4.88,10.7 4.47,10.8 4.78,10.8
  cutout Bottom: 68.48,14.12 68.07,14.53 67.97,14.43
  cutout Top: 72.03,26.01 72.14,25.91 72.54,25.91 72.54,26.62 72.44,26.72 72.34,26.82 72.03,26.82
  cutout Top: 72.14,27.94 72.14,28.55 69.8,28.55 69.39,28.14 69.39,27.33 69.49,27.23 70.41,27.23 71.42,27.23
  cutout Top: 74.98,26.21 74.57,25.81 74.27,25.81 73.76,25.81 73.56,25.6 73.46,25.5 73.46,23.77 74.57,23.77 74.68,23.88 74.68,24.89 75.18,25.4 77.62,25.4 77.62,26.21
  cutout Top: 69.9,22.76 70.82,22.76 70.21,22.15 69.9,22.45
  cutout Top: 70.41,19.81 71.12,19.1 71.12,19.91 71.02,20.02 70.61,20.02
  cutout Top: 70,16.46 68.07,16.46 67.87,16.26 67.67,16.05 67.36,16.36 67.36,17.88 68.17,18.69 69.6,18.69 69.9,18.39 70,18.29
  cutout Top: 62.99,18.69 66.34,18.69 66.65,19 66.85,18.8 66.85,16.56 63.3,16.56 63.09,16.76 62.99,16.87
  cutout Top: 67.26,12.7 67.26,13.31 64.11,16.46 63.5,16.46 63.5,16.36 67.26,12.6
  cutout Top: 71.12,9.14 72.34,9.14 72.34,13.21 71.42,14.12 67.67,14.12 65.33,16.46 64.62,16.46 67.26,13.82 70.71,13.82 71.12,13.41
  cutout Top: 72.75,13.41 73.96,14.63 71.53,14.63
  cutout Top: 66.85,4.88 66.75,4.88 66.24,5.38 67.36,6.5 67.77,6.1 67.77,5.99 67.77,5.79
  cutout Top: 61.47,4.57 62.18,4.57 62.69,5.08 62.69,5.89 62.69,6.71 61.47,5.49
  cutout Top: 61.77,8.94 61.77,6.91 61.98,6.71 63.2,7.92 63.2,8.94
  cutout Top: 58.22,6.5 58.32,6.6 58.32,8.94 58.12,8.94 57.71,8.53 57.71,7.01
  cutout Top: 60.86,12.8 60.86,11.28 61.67,10.46 61.87,10.26 65.94,10.26 66.65,10.97 66.65,12.7 66.65,12.8 66.24,13.21 66.24,12.5 63.4,12.5 62.99,12.9 60.96,12.9
  cutout Top: 61.26,31.39 61.26,30.68 55.17,30.68 55.88,31.39
  cutout Top: 48.87,23.67 48.87,23.06 49.38,23.57 49.28,23.67
  cutout Top: 46.63,21.54 46.02,20.93 46.02,21.74 46.43,21.74
  cutout Top: 50.7,16.56 50.7,16.05 50.6,15.95 48.26,15.95 46.84,17.37 46.84,17.68 47.24,17.68 48.46,16.46 50.6,16.46
  cutout Top: 52.63,16.76 54.97,16.76 54.97,15.54 52.63,15.54
  cutout Top: 50.8,14.02 50.8,13.51 48.67,13.51 48.26,13.92 50.7,13.92
  cutout Top: 53.24,12.4 53.75,12.4 54.97,13.61 54.97,14.53 54.46,14.53 53.24,13.31
  cutout Top: 57.4,8.74 56.69,9.45 56.69,9.55 57.91,9.55 57.91,9.25
  cutout Top: 53.24,6.71 53.24,9.14 52.73,8.64 52.73,7.11 53.14,6.71
  cutout Top: 52.53,9.04 51.71,9.86 53.24,9.86 53.24,9.75
  cutout Top: 48.16,7.52 48.16,6.71 47.75,7.11
  cutout Top: 43.18,7.11 43.18,9.35 42.67,8.84 42.67,7.62
  cutout Top: 46.74,16.66 45.31,18.08 46.23,18.08 47.04,17.27 47.04,16.97
  cutout Top: 42.98,19.61 42.88,19.71 42.88,20.02 43.38,20.02 43.38,19.61
  cutout Top: 40.94,12.8 40.44,12.8 40.44,12.6 40.64,12.4 40.84,12.4 40.84,12.7
  cutout Top: 42.98,23.37 42.98,21.64 43.08,21.54 43.08,20.83 43.59,21.34 43.59,23.47 43.08,23.47
  cutout Top: 39.73,19.81 39.73,19.3 41.05,20.62 40.13,20.62 39.73,20.22 39.73,19.91
  cutout Top: 38.2,22.56 38.2,21.95 38.4,21.95 38.91,22.45 40.54,22.45 40.64,22.56 41.45,23.37 41.45,23.77 38.71,23.77 38.3,23.37 38.2,23.27
  cutout Top: 44.4,25.91 45.11,26.62 43.69,26.62
  cutout Top: 35.15,23.37 35.26,23.27 37.59,23.27 37.8,23.47 38.3,23.98 38.3,24.08 34.95,24.08 34.95,23.57
  cutout Top: 33.43,24.18 33.43,23.57 34.44,24.59 34.44,24.69 34.24,24.89 34.14,24.89
  cutout Top: 38.1,16.97 37.59,16.97 37.39,16.76 37.39,15.24 37.59,15.04 38.1,15.04
  cutout Top: 34.44,12.29 33.43,13.31 31.7,13.31 32.72,12.29 32.82,12.29
  cutout Top: 35.15,13.31 35.15,12.19 33.83,13.51 33.83,13.61 34.65,14.43 35.15,14.43
  cutout Top: 33.32,32.11 32.31,32.11 31.6,32.82 31.6,35.76 33.32,34.04
  cutout Top: 28.24,38.3 28.35,38.4 28.96,38.4 28.96,40.03 28.65,40.34 28.24,39.93
  cutout Top: 26.72,22.86 28.35,22.86 28.96,23.47 30.68,23.47 30.68,24.18 27.74,24.18 27.43,24.49 27.43,25.6 26.52,26.52 26.31,26.52 26.01,26.21 26.01,23.67 26.01,23.57
  cutout Top: 28.55,21.44 28.55,20.73 28.14,21.13 28.14,21.44
  cutout Top: 28.35,19.1 28.35,18.59 27.64,17.88 27.64,15.34 26.92,16.05 26.92,19.1
  cutout Top: 28.45,11.58 28.96,11.58 29.36,11.99 29.36,13.11 28.75,13.11 28.35,12.7 28.35,11.68
  cutout Top: 21.44,4.47 22.45,4.47 22.56,4.57 22.66,4.67 22.66,6.81 21.44,5.59
  cutout Top: 21.84,12.6 23.67,12.6 23.67,13.41 24.38,12.7 24.38,10.36 22.05,10.36 21.84,10.57
  cutout Top: 20.93,24.38 22.96,24.38 22.96,24.79 21.44,26.31 21.44,26.92 20.93,26.42
  cutout Top: 20.73,35.56 22.66,35.56 22.66,36.07 21.23,36.07
  cutout Top: 22.15,38.81 21.44,38.1 21.44,37.8 22.66,37.8 22.66,38.3
  cutout Top: 19.41,20.32 19.3,20.32 18.59,19.61 20.02,19.61 20.02,20.32
  cutout Top: 19.91,16.46 19.51,16.46 19.51,18.69 19.91,18.69
  cutout Top: 20.12,15.04 19.91,15.04 19.41,15.54 19.41,14.73 19.81,14.73
  cutout Top: 18.59,10.36 18.59,10.06 19.3,10.06 19.91,10.67 19.91,12.5 19.41,12.5 18.59,11.68
  cutout Top: 18.59,4.47 17.78,4.47 17.27,4.98 17.27,6.6 18.59,5.28
  cutout Top: 15.04,22.15 17.27,22.15 17.27,23.06 15.95,23.06
  cutout Top: 14.12,18.59 14.12,17.88 12.6,17.88 12.6,18.08 13.11,18.59
  cutout Top: 4.88,11.38 4.88,10.26 4.98,10.16 5.69,10.16 12.9,17.37 12.4,17.88 12.19,17.88 8.23,13.92 4.98,13.92 4.98,11.48
  cutout Bottom: 54.25,37.9 54.25,37.19 54.25,35.66 53.75,35.15 53.54,35.15 53.54,37.59 53.85,37.9
  cutout Bottom: 60.25,40.44 59.74,39.93 59.64,39.93 59.44,39.73 59.44,38.81 60.45,38.81 60.66,39.01 60.66,40.44 61.26,41.05 61.16,41.15 60.86,41.15 60.25,40.54
  cutout Bottom: 65.33,35.86 65.23,35.76 65.23,35.15 65.74,35.66 65.74,35.86
  cutout Bottom: 66.55,35.86 66.55,35.26 66.24,35.56 66.24,35.86
  cutout Bottom: 63.4,33.22 63.4,32.31 62.89,32.82 63.3,33.22
  cutout Bottom: 56.39,35.76 56.39,35.36 56.59,35.56 57.1,35.56 57.1,35.76 56.9,35.97 56.59,35.97
  cutout Bottom: 53.44,33.32 53.64,33.32 54.25,33.93 53.64,34.54 53.44,34.34 53.44,33.43
  cutout Bottom: 52.12,39.22 53.04,39.22 52.43,39.83 52.43,41.15 51.71,40.44 51.71,40.34 51.71,39.62
  cutout Bottom: 49.68,40.03 50.8,40.03 50.8,39.42 49.99,38.61 48.06,38.61 48.06,39.32 48.16,39.42 48.77,40.03
  cutout Bottom: 48.16,39.32 44.7,39.32 44.3,38.91 44.3,38.71 44.4,38.81 48.16,38.81
  cutout Bottom: 42.98,39.32 42.37,38.71 42.37,38.61 43.38,38.61 43.38,38.91
  cutout Bottom: 44.7,36.88 45.62,36.88 45.62,37.49 46.13,38 46.13,38.2 42.77,38.2 42.16,37.59 42.06,37.49 42.06,36.88
  cutout Bottom: 45.52,32.31 45.21,32.31 45.11,32.41 45.11,32 44.81,31.7 44.91,31.6 45.62,31.6 45.82,31.8 45.82,32.11 45.62,32.31
  cutout Bottom: 47.55,34.75 47.55,34.24 47.45,34.34 45.72,34.34 45.72,34.44 46.02,34.75
  cutout Bottom: 52.73,26.01 51.92,26.82 53.04,26.82 53.04,26.31
  cutout Bottom: 43.08,30.78 43.08,29.87 42.57,30.38 42.98,30.78
  cutout Top: 26.11,46.84 26.82,46.84 27.64,46.84 27.74,46.74 27.74,45.01 27.84,44.91 28.45,44.91 28.96,44.91 30.28,46.23 30.28,46.74 29.06,47.96 28.96,47.96 26.21,47.96 26.11,47.85
  cutout Top: 33.02,46.02 33.02,45.52 33.93,45.52 33.93,46.02
  cutout Top: 35.56,46.02 35.56,45.52 36.47,45.52 36.47,46.13 36.37,46.02
  cutout Top: 38,46.02 38,45.52 38.91,45.52 38.91,46.02
  cutout Top: 37.19,43.08 38.1,43.08 38.3,43.08 38.81,42.57 48.56,42.57 48.67,42.47 48.87,42.27 37.59,42.27 37.19,42.67
  cutout Top: 40.94,38.81 40.94,37.9 41.66,37.9 42.27,37.29 42.27,38.2 41.66,38.81
  cutout Top: 46.63,36.27 47.96,36.27 48.06,36.17 48.06,37.39 47.14,37.39 47.14,36.78
  cutout Top: 45.31,36.37 46.02,36.37 47.04,37.39 48.16,37.39 49.38,37.39 49.68,37.69 49.68,39.22 49.38,38.91 48.36,38.91 47.96,38.51 45.92,38.51 45.31,37.9
  cutout Top: 51.82,38.91 53.64,38.91 53.85,39.12 53.04,39.12 52.43,39.73 52.32,39.73 52.22,39.62 51.82,39.22
  cutout Top: 41.66,36.27 42.37,36.27 42.37,36.78 42.16,36.78
  cutout Top: 47.14,39.42 48.26,39.42 48.26,39.12 47.96,38.81 46.84,38.81 46.84,39.12
  cutout Top: 45.21,32.51 46.23,32.51 45.21,31.5
  cutout Top: 46.53,32.92 47.35,33.73 47.35,32.82 47.04,32.51 46.94,32.51
  cutout Top: 42.77,29.06 44.2,30.48 43.79,30.89 43.79,32.51 43.48,32.51 43.08,32.11 43.08,30.38 42.88,30.18 42.37,30.18 42.37,29.46
  cutout Top: 47.75,31.8 48.06,31.5 48.06,31.29 47.65,30.89 47.24,31.29
  cutout Top: 49.58,32.92 50.19,33.53 50.29,33.53 50.29,32.31 50.19,32.31
  cutout Top: 48.56,40.44 48.56,41.35 49.38,40.54 49.38,40.44
  cutout Top: 56.59,39.73 56.18,40.13 54.36,38.3 54.36,37.8 54.66,37.8
  cutout Top: 53.64,37.59 53.64,37.08 54.15,37.59
LED0  (via drill 0.35)
  Top 0.152: U1.31 51.73,31.17 51.73,35.24 50.49,36.47 50.49,40.84 48.67,42.67 38.91,42.67 v38.5,43.08
  Bottom 0.152: R35.1 v38.5,43.08
LED1  (via drill 0.35)
  Top 0.152: U1.32 51.31,31.46 51.31,35.23 50.19,36.35 50.19,40.54 48.67,42.06 37.59,42.06 v36.73,42.92
  Bottom 0.152: 36.78,42.87 v36.73,42.92 R36.1
LED2  (via drill 0.35)
  Top 0.152: U1.33 50.9,31.76 50.9,35.21 49.89,36.22 49.89,40.34 48.71,41.51 v40.84,41.51
  Bottom 0.152: v40.84,41.51 35.68,41.51 33.54,43.65 R39.1
LED_BLUE
  Top 0.152: R6.2 37.59,23.1 37.63,23.1 | 37.63,23.1 R3.2 | U1.3 42.41,23.98 38.51,23.98 37.63,23.1
LED_CAN
  Top 0.152: U1.25 55.28,30.48 63.3,30.48 63.91,31.09 64.88,31.09 CN1.12
LED_GREEN  (1 unrouted)
  Top 0.152: R5.2 30.1,21.74 31.8,21.74 34.34,24.28 42.01,24.28 U1.2 | R2.2 30,21.74
LED_RED
  Top 0.152: R4.2 R1.2 | R1.2 | U1.1 39.68,29.46 23.67,29.46 20.73,26.52 20.73,22.96 19.51,21.74 R1.2
LEDA
  Bottom 0.152: IC2.15 11.32,17.64 10.67,18.29 | 10.67,18.29 10.61,18.35 | 10.67,18.29 9.55,18.29 6.91,15.65 3.15,15.65 0.51,18.29 0.51,23.27 1.52,24.28 DZ4.1
LEDB
  Bottom 0.152: DZ4.2 5.62,24.37 6.77,24.37 7.58,23.56 10.05,23.56 IC2.1
LEDC
  Bottom 0.152: DZ4.3 8.14,24.38 10.67,24.38 11.32,23.73 IC2.2
LEDD
  Bottom 0.152: DZ4.4 10.38,24.69 11.12,24.69 11.34,24.48 11.9,24.48 12.6,23.78 IC2.3
LEDE
  Bottom 0.152: IC2.4 13.87,23.73 11.69,25.91 DZ4.5
LEDF
  Bottom 0.152: IC2.5 15.13,23.68 14.22,24.59 DZ4.6
LEDG
  Bottom 0.152: IC2.6 16.41,25.56 DZ4.7
LEDH
  Bottom 0.152: IC2.7 17.68,23.67 19.3,25.3 DZ4.8
LEDI
  Bottom 0.152: IC6.15 23.32,17.52 21.03,19.81 21.03,24.7 DZ5.1
LEDJ
  Bottom 0.152: IC6.1 22.05,23.78 24.09,25.81 DZ5.2
LEDK
  Bottom 0.152: IC6.2 23.32,23.63 24.06,24.37 25.03,24.37 26.48,25.81 DZ5.3
LEDL
  Bottom 0.152: IC6.3 25.1,23.07 25.2,23.18 25.2,24.08 25.49,24.37 27.57,24.37 29.02,25.81 DZ5.4
LEDM  (via drill 0.35)
  Top 0.152: DZ5.5 30.86,27.26 26.88,27.26 26.13,26.52 26.11,26.52 25.86,26.27 v25.86,23.28
  Bottom 0.152: v25.86,23.28 IC6.4
LEDN  (via drill 0.35)
  Top 0.152: DZ5.6 33.4,24.37 31.96,24.37 31.94,24.38 30.13,24.38 30.11,24.37 29.42,24.37 29.4,24.38 27.74,24.38 v27.13,23.77
  Bottom 0.152: v27.13,23.77 v27.14,23.77 IC6.5
LEDO
  Bottom 0.152: IC6.6 28.41,23.73 28.99,24.32 36.31,24.32 37.38,25.39 DZ5.7
LEDP
  Bottom 0.152: IC6.7 29.68,22.34 30.58,21.44 35.56,21.44 DZ5.8
N$1
  Bottom 0.61: LED2.BC LED1.BA
N$2
  Bottom 0.61: LED2.GC LED1.GA
N$3
  Bottom 0.61: LED2.RC LED1.RA
N$4  (via drill 0.35)
  Top 0.152: v21.74,19.96 v20.42,19.96
  Bottom 0.152: IC2.9 18.95,18.79 20.12,19.96 v20.42,19.96 | v21.74,19.96 22.25,19.96 24.59,17.62 IC6.14
N$5
  Bottom 0.61: LED3.BC LED2.BA
N$6
  Bottom 0.61: R32.2 CN1.9
N$7
  Top 0.152: R2_1.1 R2_2.2 52.69,15.04 51.1,15.04 50.43,14.37 IC11.6
N$8
  Bottom 0.61: LED3.GC LED2.GA
N$9
  Bottom 0.61: LED3.RC LED2.RA
N$10
  Top 0.152: DZ4.9 19.3,34.43 RN5.9
N$11
  Top 0.152: R1_1.1 41.84,16.89 | 41.84,16.89 41.85,16.9 R1_2.2 | IC11.2 42.48,15.63 41.84,16.28 41.84,16.89
N$12
  Bottom 0.152: R33.2 65.9,34.85 CN1.11
N$13
  Bottom 0.61: LED4.BC LED3.BA
N$14
  Bottom 0.61: LED4.GC LED3.GA
N$15
  Bottom 0.61: LED4.RC LED3.RA
N$16
  Bottom 0.61: LED5.BC LED4.BA
N$17
  Bottom 0.61: LED5.GC LED4.GA
N$18
  Bottom 0.61: LED5.RC LED4.RA
N$19  (1 unrouted)
N$20  (1 unrouted)
N$21
  Bottom 0.61: LED6.RC LED5.RA
N$22
  Bottom 0.61: LED7.BC LED6.BA
N$23
  Bottom 0.61: LED7.GC LED6.GA
N$24
  Bottom 0.61: LED7.RC LED6.RA
N$25
  Bottom 0.61: LED8.BC LED7.BA
N$26
  Bottom 0.61: LED8.GC LED7.GA
N$27
  Bottom 0.61: LED8.RC LED7.RA
N$28
  Bottom 0.61: LED9.BC LED8.BA
N$29
  Bottom 0.61: LED9.GC LED8.GA
N$30
  Bottom 0.61: LED9.RC LED8.RA
N$31
  Bottom 0.61: LED10.BC LED9.BA
N$32
  Bottom 0.61: LED10.GC LED9.GA
N$33
  Bottom 0.61: LED10.RC LED9.RA
N$34
  Top 0.152: DZ4.10 16.77,34.43 RN5.8
N$35
  Top 0.152: DZ4.11 14.22,34.43 RN5.7
N$36
  Bottom 0.61: CN1.5 60.99,40.32 CN1.4 60.99,38.75 F1.2
N$37  (via drill 0.35)
  Top 0.152: D10.A R36.2
  other vias: 36,45.35
N$38  (via drill 0.35)
  Top 0.152: D9.A R35.2
  other vias: 38.5,45.35
N$39  (via drill 0.35)
  Top 0.152: U1.6 43.28,22.72 X1.3
  other vias: 43.28,21.91
N$40  (via drill 0.35)
  Top 0.152: U1.5 43.42,23.57 41.66,23.57 v40.84,22.76
  Bottom 0.152: v40.84,22.76 40.88,22.72 X1.1
N$41
  Top 0.152: SW1.P$1 15.75,47.5 R37.1
N$42
  Top 0.152: IC4.3 63.9,12.1 63,13 R44.1
N$43  (1 unrouted)
N$44  (via drill 0.35)
  Top 0.152: D11.A R39.2
  other vias: 33.5,45.35
N$45  (via drill 0.35)
  Top 0.61: U6.7 U6.8 U6.1
  Bottom 0.61: R40.2 77.94,29.02 77.94,28.98 77.87,28.91 U6.8
  other vias: 76.75,28.91
N$46
  Top 0.61: L1.P$1 65.6,27.82 65.6,28.65 | 65.6,28.65 D8.C | U6.2 70.71,27.64 69.7,28.65 65.6,28.65
N$47  (via drill 0.35)
  Top 0.152: U6.3 72.69,26.36 v72.75,26.42
  Bottom 0.152: v72.75,26.42 74,26.42 C17.1
N$48  (via drill 0.35)
  Top 0.61: v73.97,25.4 75.89,25.4 76.2,25.09 U6.5
  Bottom 0.61: R42.2 70.5,24.99 | 70.5,24.99 R41.1 | 70.5,24.99 70.91,25.4 v73.97,25.4
N$49  (via drill 0.35)
  Top 0.152: v20.45,12.92 20.7,12.67 20.75,12.67 21.59,11.83 IC1.3 | v40,12.78 40.62,12.15 R43.1
  Bottom 0.152: v20.45,12.92 39.81,12.92 39.95,12.78 v40,12.78
N$50
  Bottom 0.152: LED6.GC 42.78,12 43.48,12.7 43.48,14.66 R20.2
N$51
  Bottom 0.152: LED6.BC 42.76,10.25 43.99,11.48 43.99,14.04 R19.2
N$52  (via drill 0.35)
  Top 0.152: R17.1 6.1,12 7.15,13.06 7.92,13.06 12.55,17.68 17.48,17.68 17.78,17.98 17.78,18.49 18.68,19.39 26.49,19.39 IC5.3 27,19.62 27.34,19.28 31.32,19.28 33.04,17.55 v35.08,17.55
  Bottom 0.152: R20.1 42.27,17.58 35.1,17.58 v35.08,17.55
N$53
  Top 0.152: R1.1 15.91,22.76 15.34,22.76 14.45,21.87 IC3.1
N$54
  Top 0.152: R16.1 8.41,14.1 13.5,19.19 IC3.3
N$55
  Top 0.152: DZ4.12 11.69,34.43 RN5.6
N$56
  Top 0.152: DZ4.13 9.14,34.43 RN5.5
N$57
  Top 0.152: DZ4.14 6.61,34.43 RN5.4
N$58
  Top 0.152: DZ4.15 4.07,34.43 RN5.3
N$59
  Top 0.152: DZ4.16 1.52,34.43 RN5.2
N$60
  Bottom 0.152: DZ5.12 30.41,35.33 RN6.6
N$61
  Bottom 0.152: DZ5.11 32.95,35.33 RN6.7
N$62
  Bottom 0.152: DZ5.10 35.49,35.33 RN6.8
N$63
  Bottom 0.152: DZ5.9 38.03,35.33 RN6.9
N$64
  Top 0.152: DZ5.13 27.87,35.33 RN6.5
N$65
  Top 0.152: DZ5.14 25.33,35.33 RN6.4
N$66
  Top 0.152: DZ5.15 22.79,35.33 RN6.3
N$67
  Bottom 0.152: DZ5.16 20.25,35.33 RN6.2
N$284
  Top 0.152: IC5.1 27.95,22.26 29.04,23.35 R2.1
N$285  (via drill 0.35)
  Top 0.152: R18.1 5.63,9.9 13.11,17.37 17.6,17.37 18.09,17.86 18.09,18.26 18.5,18.68 18.73,18.92 24.46,18.92 24.79,18.59 24.79,16.21 27.19,13.82 34.04,13.82 35.3,15.07 36.84,15.07 37.41,15.63 37.41,18.49 IC7.3 v37,19.07
  Bottom 0.152: v37,19.07 45.04,19.07 45.46,18.65 45.46,17.21 R19.1
N$286
  Top 0.152: IC7.1 37.95,21.39 38.71,22.15 38.71,22.46 R3.1
PD0
  Top 0.152: RN1.9 7.86,2 3.56,6.3 3.35,6.3 2.48,7.17 PD0.A 2.48,8.17 2.64,8.33 5.08,8.33 8.18,11.43 IC1.1
PD1
  Top 0.152: RN1.8 9.38,6.2 8.13,6.2 7.48,6.85 PD1.A 7.48,9 8.33,9.86 19.41,9.86 20.32,10.78 IC1.2
PD2
  Top 0.152: RN1.7 16.12,3.49 12.48,7.13 PD2.A 12.48,8.42 13.41,9.35 21.54,9.35 22.86,10.67 IC1.4
PD3
  Top 0.152: RN1.6 18.66,5.52 17.48,6.7 PD3.A 17.48,8.44 17.88,8.84 22.25,8.84 24.14,10.72 IC1.5
PD4
  Top 0.152: RN1.5 21.2,5.55 22.48,6.83 PD4.A 22.48,8.05 23.37,8.94 24.08,8.94 24.69,9.55 24.69,12.64 21.59,15.75 21.44,15.75 20.32,16.86 IC1.15
PD5
  Top 0.152: RN1.4 23.74,4.03 PD5.A 29.16,9.45 29.16,12.09 28.35,12.9 25.5,12.9 21.59,16.81 IC1.14
PD6
  Top 0.152: RN1.3 28.65,4.37 29.06,4.37 32.46,7.78 PD6.A 32.48,12.22 31.5,13.21 26.52,13.21 23.06,16.66 23.06,17.38 IC1.13
PD7
  Top 0.152: RN1.2 30.68,3.86 34.34,3.86 37.48,7 PD7.A 37.48,9.56 33.53,13.51 26.82,13.51 24.14,16.2 IC1.12
PD8
  Top 0.152: RN2.9 48.39,2 44.2,6.2 43.79,6.2 42.48,7.51 PD8.A 42.48,8.85 45.01,11.38 61.31,11.38 IC4.1
PD9
  Top 0.152: RN2.8 51.31,4.37 50.29,4.37 47.48,7.18 PD9.A 47.48,9.38 48.16,10.06 61.87,10.06 62.62,10.81 IC4.2
PD10
  Top 0.152: RN2.7 56.22,3.42 52.48,7.16 PD10.A 52.48,8.69 53.44,9.65 64.21,9.65 65.17,10.61 IC4.4
PD11
  Top 0.152: RN2.6 58.76,5.65 57.48,6.93 PD11.A 57.48,8.61 58.01,9.14 64.92,9.14 66.44,10.66 IC4.5
PD12
  Top 0.152: RN2.5 61.27,2.04 61.27,5.59 62.48,6.8 PD12.A 62.48,8.23 62.89,8.64 66.04,8.64 67.16,9.75 67.16,10.3 67.15,10.32 67.15,12.41 62.62,16.93 IC4.15
PD13
  Top 0.152: RN2.4 63.84,3.19 67.48,6.83 PD13.A 67.48,8.15 68.68,9.35 71.02,9.35 71.42,9.75 71.42,12.8 70.61,13.61 67.16,13.61 63.9,16.88 IC4.14
PD14
  Top 0.152: RN2.3 70.68,6.3 71.22,6.3 72.48,7.56 PD14.A 72.48,13.27 71.42,14.33 67.67,14.33 65.17,16.83 IC4.13
PD15
  Top 0.152: RN2.2 70.98,4.06 73.15,4.06 75.39,6.3 76.5,6.3 77.48,7.27 PD15.A 77.48,12.44 75.08,14.83 68.58,14.83 66.44,16.98 IC4.12
PD_A
  Top 0.152: IC11.1 43.89,16.91 43.89,18.49 43.55,18.83 R1_2.1 43.55,20.16 U1.10
PD_B  (via drill 0.35)
  Top 0.152: R2_2.1 51.59,15.63 IC11.7 48.27,15.63 v46.43,17.48 | U1.11 45.82,21.73 v45.82,19.3
  Bottom 0.152: v46.43,17.48 45.82,18.09 v45.82,19.3
PD_PREA  (via drill 0.35)
  Top 0.152: v39.42,14.73 40.62,14.73 R43.2 41.87,14.22 44.26,14.22 IC11.3 45.35,14.37 46.84,15.85 v46.84,16.15 | v37.59,14.73 37.49,14.63 36.27,14.63 36,14.36 C24.1 | U1.13 49.57,21.77 48.46,20.66 48.46,18.49 v48.03,18.06
  Bottom 0.152: v39.42,14.73 v37.59,14.73 | v48.03,18.06 46.84,16.87 v46.84,16.15
PD_PREB  (via drill 0.35)
  Top 0.152: U1.14 49.55,22.53 50.2,21.88 50.2,21.55 49.17,20.52 49.17,18.07 v48.79,17.68 | v48.08,15.08 48.08,13.8 48.78,13.1 IC11.5 52.55,13.1 R44.2 54.41,14.76 v58.55,14.76
  Bottom 0.152: v48.79,17.68 48.08,16.97 v48.08,15.08 | v58.55,14.76 59.21,14.76 C25.1
PD_SIG1  (via drill 0.35)
  Top 0.152: IC1.11 25.32,17.66 v25.32,18.84 | v23.13,21.2 23.13,27.8 24.18,28.85 v39.42,28.85 | v41.17,28.84 41.77,28.84 43.82,26.8 47.07,26.8 v47.35,26.52 | v48.87,25.5 50.79,25.5 U1.20 51.65,24.65 56.29,20.02 v59.47,20.02 | IC4.11 67.7,18.28 65.97,20.02 v60.86,20.02
  Bottom 0.152: v25.32,18.84 23.13,21.04 v23.13,21.2 | v39.42,28.85 41.16,28.85 v41.17,28.84 | v48.87,25.5 48.36,25.5 v47.35,26.52 | v60.86,20.02 v59.47,20.02
PD_SIG2  (via drill 0.35)
  Top 0.152: IC1.10 26.52,17.73 v26.52,18.72 | v23.98,21.23 23.44,21.77 23.44,27.6 24.08,28.25 40.12,28.25 v41.89,26.48 | v49.56,24.9 50.68,24.9 U1.19 51.29,24.23 v54.52,21 | IC4.10 68.97,18.3 66.45,20.83 v60.83,20.83 | v59.44,20.82 56.27,20.82 v56.07,21.02
  Bottom 0.152: v26.52,18.72 24.01,21.23 v23.98,21.23 | v41.89,26.48 42.09,26.27 46.81,26.27 48.18,24.9 v49.56,24.9 | v60.83,20.83 v59.45,20.83 v59.44,20.82 | v56.07,21.02 54.54,21.02 v54.52,21
PD_SIG3  (via drill 0.35)
  Top 0.152: IC1.9 30.55,17.57 v31.39,18.42 | v32.61,20.12 32.67,20.17 39.88,20.17 v39.93,20.22 | v49.07,24.08 49.55,24.08 49.99,24.52 50.36,24.52 U1.18 50.93,23.8 v52.76,21.98 | IC4.9 70.25,18.15 66.72,21.67 60.96,21.67 60.93,21.64 v60.83,21.64
  Bottom 0.152: v31.39,18.42 31.39,18.9 v32.61,20.12 | v39.93,20.22 45.21,20.22 v49.07,24.08 | v60.83,21.64 53.09,21.64 v52.76,21.98
RCK  (via drill 0.35)
  Top 0.152: v15.13,16.82 17.43,14.53 20.16,14.53 v20.13,14.56 | v27.13,15.95 27.13,15.54 27.74,14.94 v27.74,14.53 | U1.38 46.62,31.62 47.53,30.7 47.53,28.42 47.37,28.26 v47.37,27.91
  Bottom 0.152: IC2.12 v15.13,16.82 | v20.13,14.56 27.71,14.56 v27.74,14.53 | IC6.12 27.13,16.92 v27.13,15.95 27.13,15.93 27.37,15.68 31.37,15.68 32.52,16.83 32.52,19.14 34.1,20.73 35.79,20.73 39.04,23.98 40.56,23.98 41.15,24.56 41.15,26.52 42.14,27.51 46.98,27.51 v47.37,27.91
SCK  (via drill 0.35)
  Top 0.152: v20.28,21.73 21.69,21.73 v21.84,21.58 | U1.40 46.53,30.46 46.53,29.06 v45.97,28.5
  Bottom 0.152: IC2.11 16.41,18.64 19.5,21.73 v20.28,21.73 20.28,30.03 21.84,31.6 41.02,31.6 44.42,28.19 45.67,28.19 v45.97,28.5 | IC6.11 28.45,16.97 28.45,17.61 24.27,21.78 22.05,21.78 v21.84,21.58
SER  (via drill 0.35)
  Top 0.152: U1.41 44.91,31.38 44.91,32.08 v44.75,32.24
  Bottom 0.152: v44.75,32.24 44.73,32.26 40.9,32.26 40.62,31.99 21.8,31.99 21.78,32 16.87,32 15.75,30.89 15.75,21.44 13.41,19.1 13.41,18.39 12.6,17.57 IC2.14
SWCLK
  Top 0.152: SV2.9 48.09,37.12 47.48,36.51 47.48,32.65 U1.37
SWDIO  (via drill 0.35)
  Top 0.152: 49.9,31.44 U1.34 50.49,32.06 50.49,34.95 49.68,35.76 48.56,35.76 48.16,36.17 48.16,36.21 v48.1,36.27
  Bottom 0.152: v48.1,36.27 47.25,37.12 SV2.8
UART_RX
  Top 0.152: SV2.3 44.81,38.09 44.81,36.68 43.89,35.76 43.89,30.99 U1.43
UART_TX
  Top 0.152: U1.42 44.2,31.39 44.2,35.56 45.11,36.47 45.11,37.9 45.87,38.66 48.01,38.66 48.92,39.57 SV2.4

### Text on the board
tNames: 3V3 | G | U_R | U_T | 5V | 5V | 3V3 | SWD | SWC | G